# EAGLE design MD2020_02-08 (EAGLE 9.2.0)

## Sheet 1 of 4
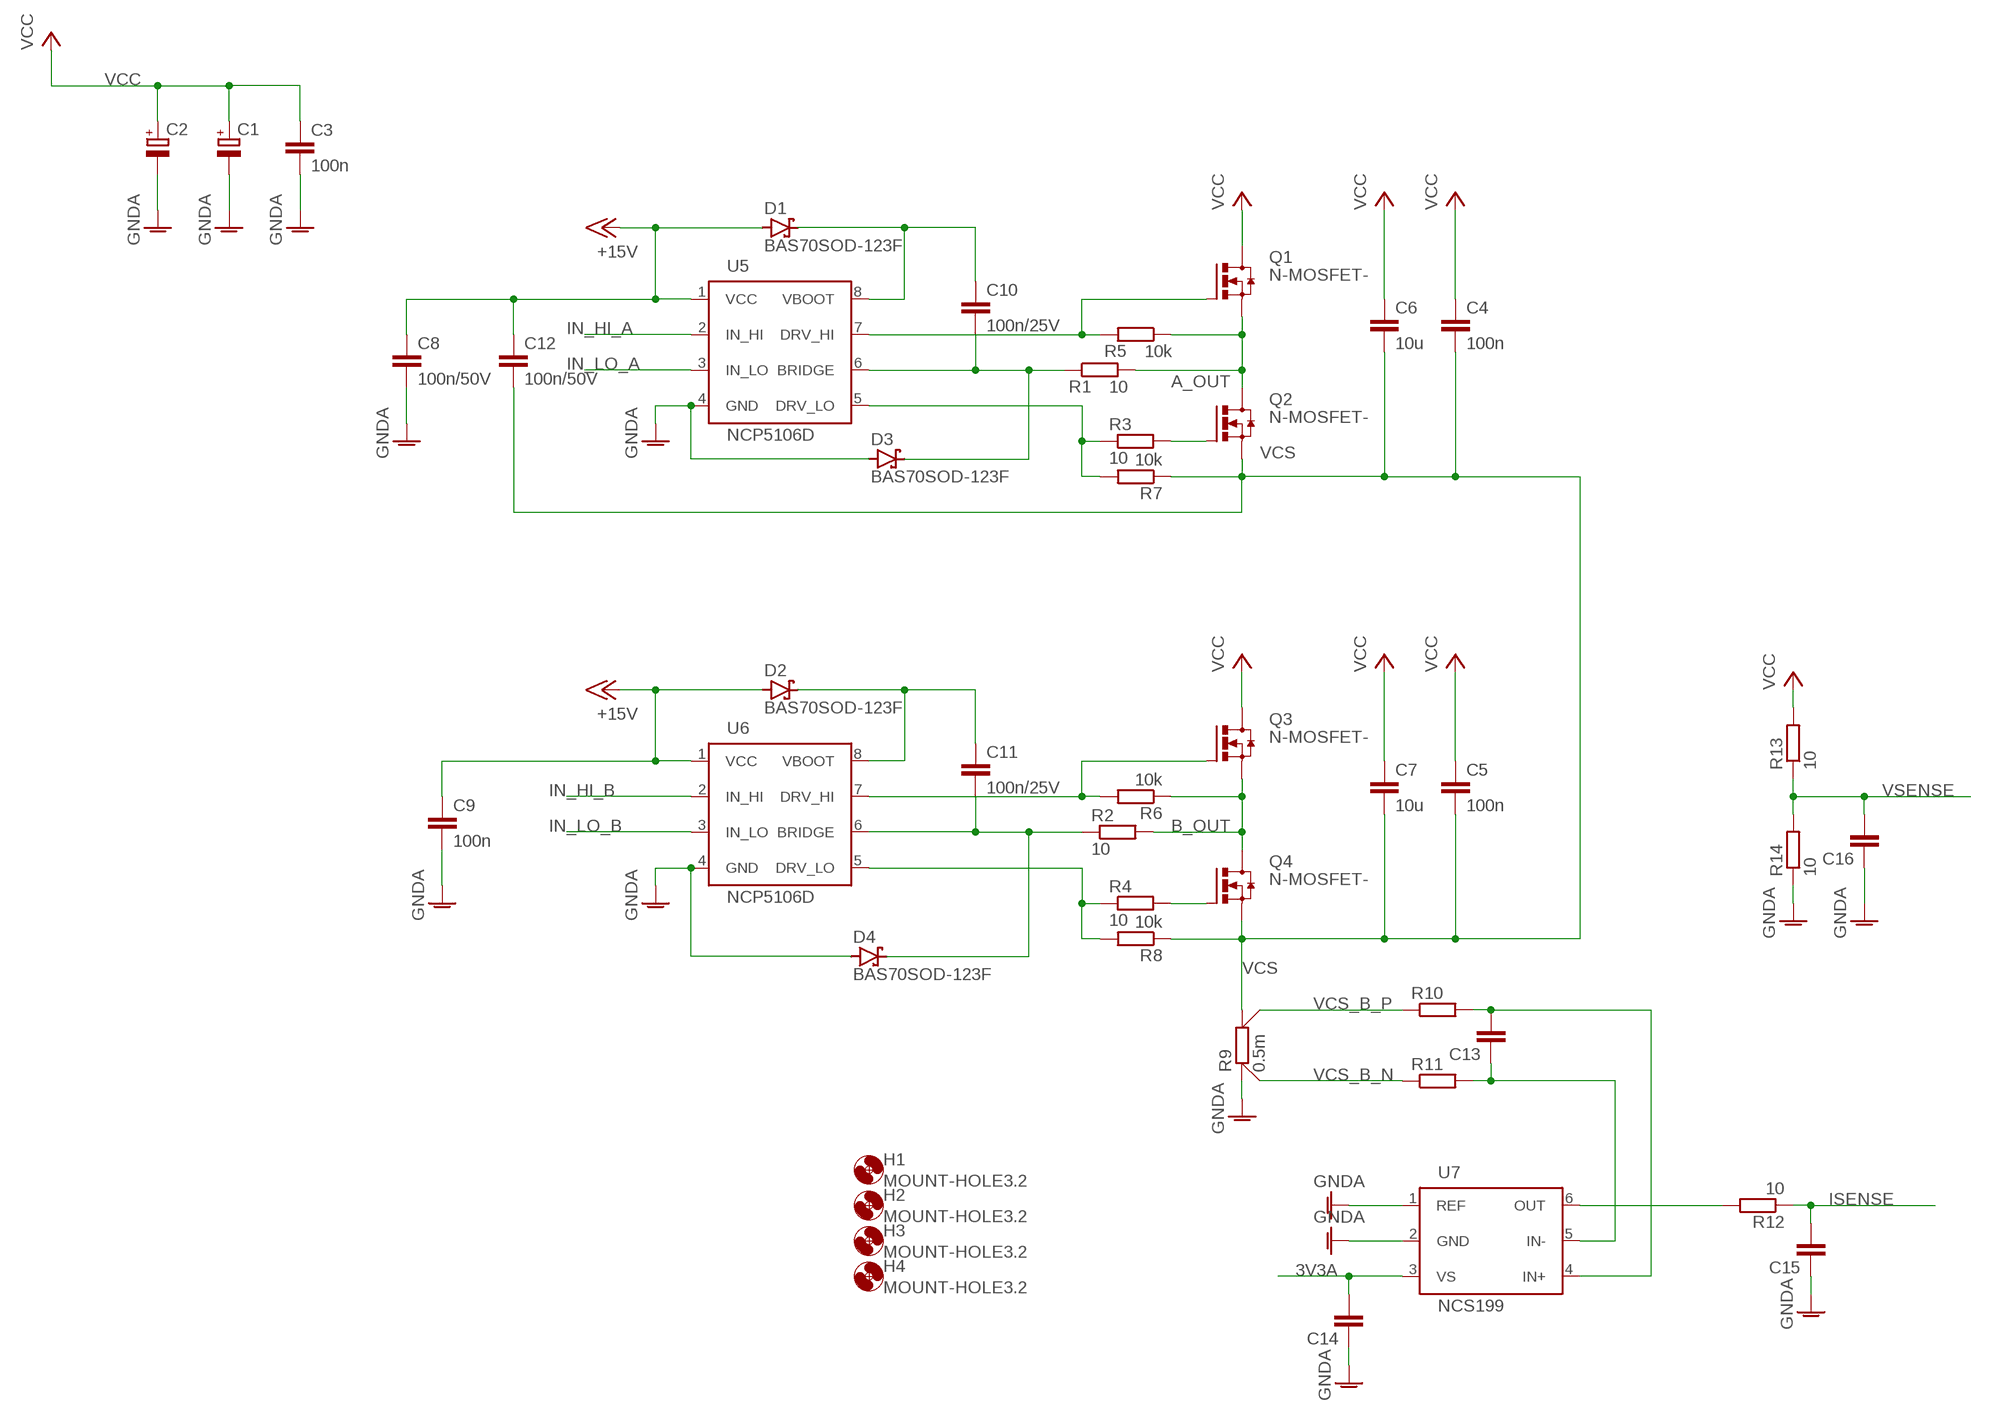
[diagram p0: schematic, sheet 1]

### Parts
C1  CPOL-EUE5-10.5  [E5-10,5]
C2  CPOL-EUE5-10.5  [E5-10,5]
C3  100n  C-EUC0603  [C0603]
C4  100n  C-EUC0603  [C0603]
C5  100n  C-EUC0603  [C0603]
C6  10u  C-EUC1210  [C1210]
C7  10u  C-EUC1210  [C1210]
C8  100n/50V  C-EUC0603  [C0603]
C9  100n  C-EUC0603  [C0603]
C10  100n/25V  C-EUC0603  [C0603]
C11  100n/25V  C-EUC0603  [C0603]
C12  100n/50V  C-EUC0603  [C0603]
C13  C-EUC0603  [C0603]
C14  C-EUC0603  [C0603]
C15  C-EUC0603  [C0603]
C16  C-EUC0603  [C0603]
D1  BAS70SOD-123F  [SOD123F]
D2  BAS70SOD-123F  [SOD123F]
D3  BAS70SOD-123F  [SOD123F]
D4  BAS70SOD-123F  [SOD123F]
H1  MOUNT-HOLE3.2  [3,2]
H2  MOUNT-HOLE3.2  [3,2]
H3  MOUNT-HOLE3.2  [3,2]
H4  MOUNT-HOLE3.2  [3,2]
Q1  N-MOSFET-  [SOT669]
Q2  N-MOSFET-  [SOT669]
Q3  N-MOSFET-  [SOT669]
Q4  N-MOSFET-  [SOT669]
R1  10  R-EU_R0603  [R0603]
R2  10  R-EU_R0603  [R0603]
R3  10  R-EU_R0603  [R0603]
R4  10  R-EU_R0603  [R0603]
R5  10k  R-EU_R0603  [R0603]
R6  10k  R-EU_R0603  [R0603]
R7  10k  R-EU_R0603  [R0603]
R8  10k  R-EU_R0603  [R0603]
R9  0.5m  CSS2H-2512  [CSS2H-2512]
R10  R-EU_R0603  [R0603]
R11  R-EU_R0603  [R0603]
R12  10  R-EU_R0603  [R0603]
R13  10  R-EU_R0603  [R0603]
R14  10  R-EU_R0603  [R0603]
U5  NCP5106D  [SOIC127P600X175-8]
U6  NCP5106D  [SOIC127P600X175-8]
U7  NCS199  [SOT65P210X110-6]

### Nets
3V3A: C14.2 U7.3(VS) ; also sheet 3
+15V: C8.1 C9.1 C12.1 D1.A D2.A U5.1(VCC) U6.1(VCC) ; also sheet 4
A_OUT: Q1.1(SOURCE) Q1.2(SOURCE) Q1.3(SOURCE) Q2.5(DRAIN) R1.2 R5.1
B_OUT: Q3.1(SOURCE) Q3.2(SOURCE) Q3.3(SOURCE) Q4.5(DRAIN) R2.2 R6.1
GNDA: C1.- C2.- C3.2 C8.2 C9.2 C14.1 C15.1 C16.1 D3.A D4.A R9.1$1 R9.1$2 R14.1 U5.4(GND) U6.4(GND) U7.1(REF) U7.2(GND) ; also sheet 2,3,4
IN_HI_A: U5.2(IN_HI) ; also sheet 3
IN_HI_B: U6.2(IN_HI) ; also sheet 3
IN_LO_A: U5.3(IN_LO) ; also sheet 3
IN_LO_B: U6.3(IN_LO) ; also sheet 3
ISENSE: C15.2 R12.1 ; also sheet 3
N$1: Q1.4(GATE) R5.2 U5.7(DRV_HI)
N$2: Q3.4(GATE) R6.2 U6.7(DRV_HI)
N$4: C10.2 D3.C R1.1 U5.6(BRIDGE)
N$5: R4.1 R8.2 U6.5(DRV_LO)
N$6: R12.2 U7.6(OUT)
N$11: R3.1 R7.2 U5.5(DRV_LO)
N$25: C11.2 D4.C R2.1 U6.6(BRIDGE)
N$36: C13.2 R10.2 U7.4(IN+)
N$37: C13.1 R11.2 U7.5(IN-)
N$61: Q2.4(GATE) R3.2
N$64: Q4.4(GATE) R4.2
N$67: C11.1 D2.C U6.8(VBOOT)
N$73: C10.1 D1.C U5.8(VBOOT)
VCC: C1.+ C2.+ C3.1 C4.1 C5.1 C6.1 C7.1 Q1.5(DRAIN) Q3.5(DRAIN) R13.2 ; also sheet 4
VCS: C4.2 C5.2 C6.2 C7.2 C12.2 Q2.1(SOURCE) Q2.2(SOURCE) Q2.3(SOURCE) Q4.1(SOURCE) Q4.2(SOURCE) Q4.3(SOURCE) R7.1 R8.1 R9.2$1 R9.2$2
VCS_B_N: R9.1S R11.1
VCS_B_P: R9.2S R10.1
VSENSE: C16.2 R13.1 R14.2 ; also sheet 3

## Sheet 2 of 4
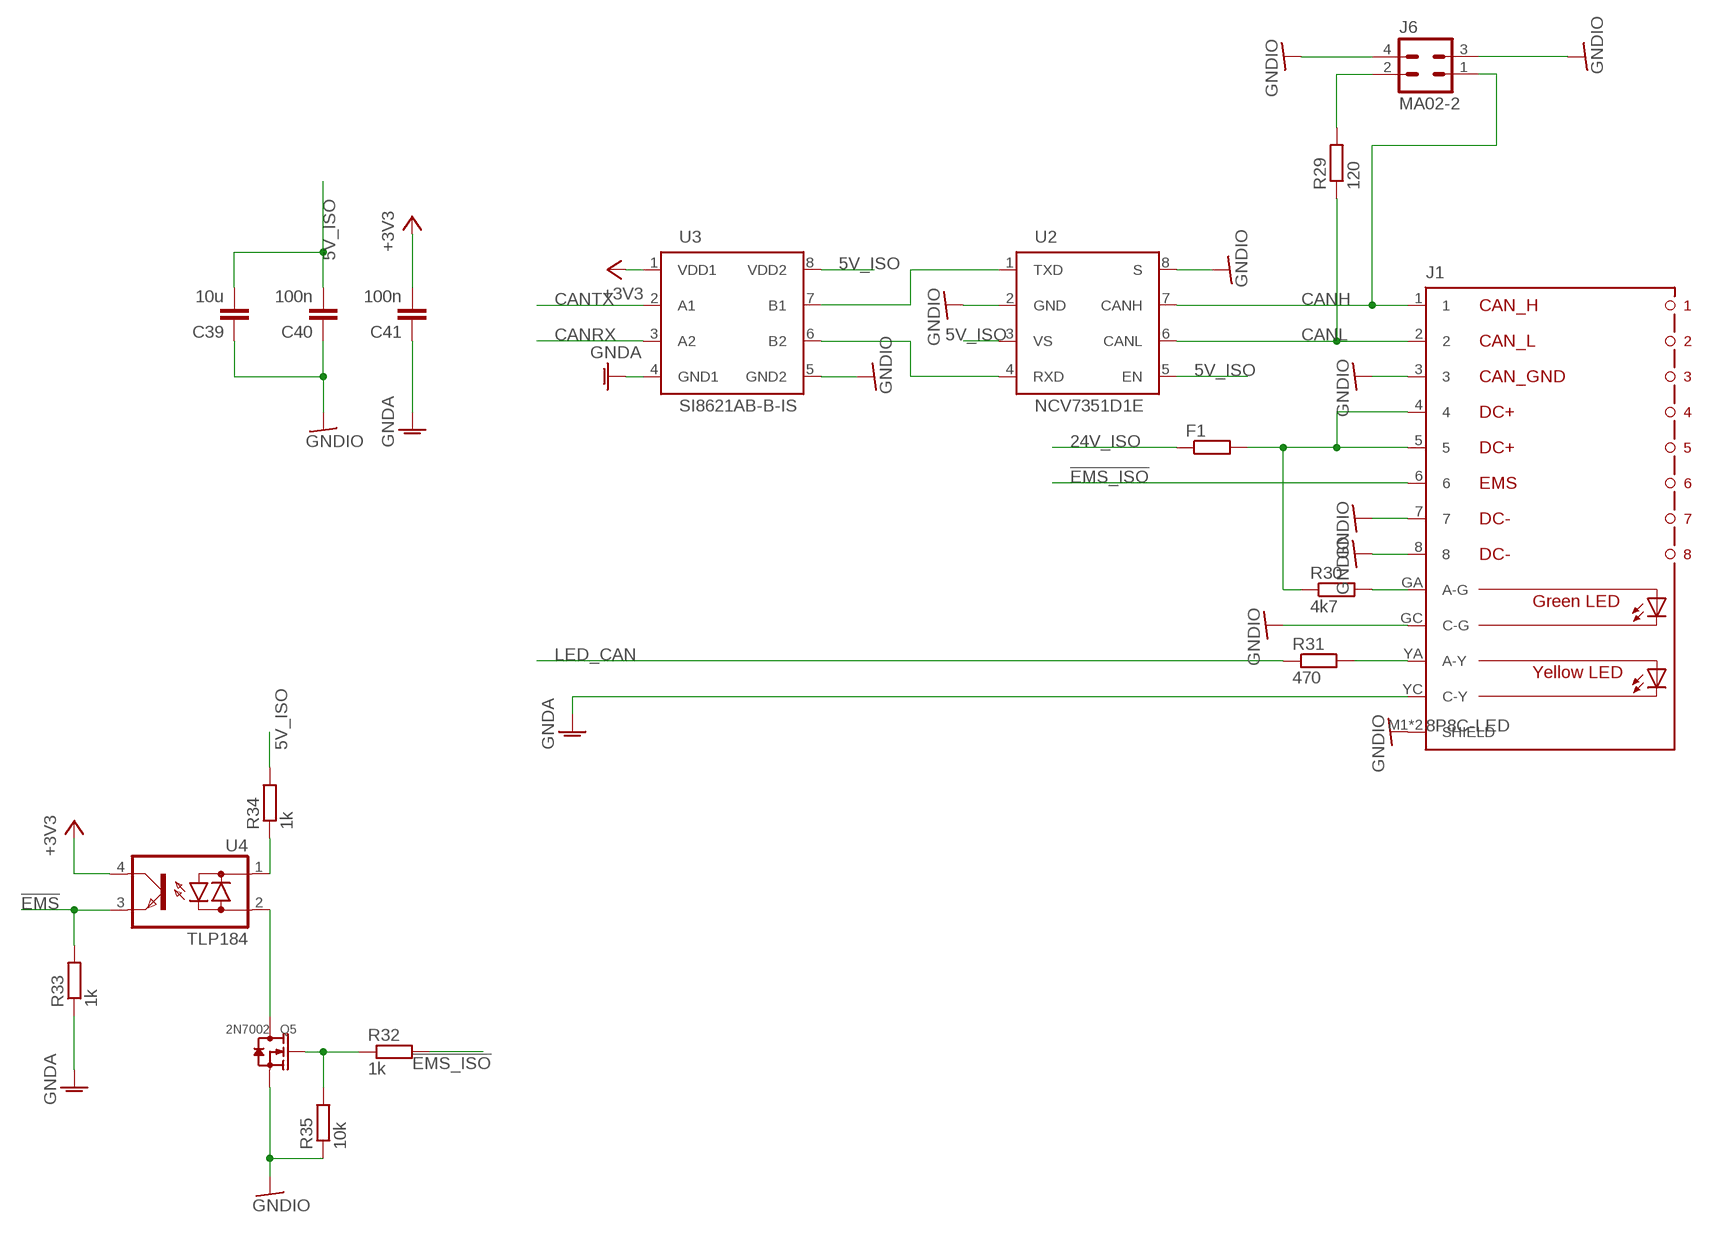
[diagram p1: schematic, sheet 2]

### Parts
C39  10u  C-EUC0805  [C0805]
C40  100n  C-EUC0603  [C0603]
C41  100n  C-EUC0603  [C0603]
F1  R-EU_R1206  [R1206]
J1  8P8C-LED  [8P8C-LED]
J6  MA02-2  [MA02-2W]
Q5  2N7002  SMD-MOSFET-N-CH-60V-300MA-LOGIC-LEVEL-FET-2N7002(SOT-23)  [SOT-23]
R29  120  R-EU_R0603  [R0603]
R30  4k7  R-EU_R0603  [R0603]
R31  470  R-EU_R0603  [R0603]
R32  1k  R-EU_R0603  [R0603]
R33  1k  R-EU_R0603  [R0603]
R34  1k  R-EU_R0603  [R0603]
R35  10k  R-EU_R0603  [R0603]
U2  NCV7351D1E  [SO08]
U3  SI8621AB-B-IS  [SO08]
U4  TLP184  [11-4M1S]

### Nets
5V_ISO: C39.2 C40.2 R34.2 U2.3(VS) U2.5(EN) U3.8(VDD2) ; also sheet 4
24V_ISO: F1.1 ; also sheet 4
!EMS: R33.2 U4.3(E) ; also sheet 3
!EMS_ISO: J1.6 R32.2
+3V3: C41.2 U3.1(VDD1) U4.4(C) ; also sheet 3,4
CANH: J1.1 J6.1 U2.7(CANH)
CANL: J1.2 R29.1 U2.6(CANL)
CANRX: U3.3(A2) ; also sheet 3
CANTX: U3.2(A1) ; also sheet 3
GNDA: C41.1 J1.YC(C-Y) R33.1 U3.4(GND1) ; also sheet 1,3,4
GNDIO: C39.1 C40.1 J1.3 J1.7 J1.8 J1.GC(C-G) J1.M1(SHIELD) J1.M2(SHIELD) J6.3 J6.4 Q5.2(S) R35.1 U2.2(GND) U2.8(S) U3.5(GND2) ; also sheet 4
LED_CAN: R31.1 ; also sheet 3
N$8: F1.2 J1.4 J1.5 R30.1
N$9: J6.2 R29.2
N$18: J1.GA(A-G) R30.2
N$20: J1.YA(A-Y) R31.2
N$22: Q5.1(G) R32.1 R35.2
N$23: U2.1(TXD) U3.7(B1)
N$27: U2.4(RXD) U3.6(B2)
N$30: Q5.3(D) U4.2(AC2)
N$31: R34.1 U4.1(AC1)

## Sheet 3 of 4
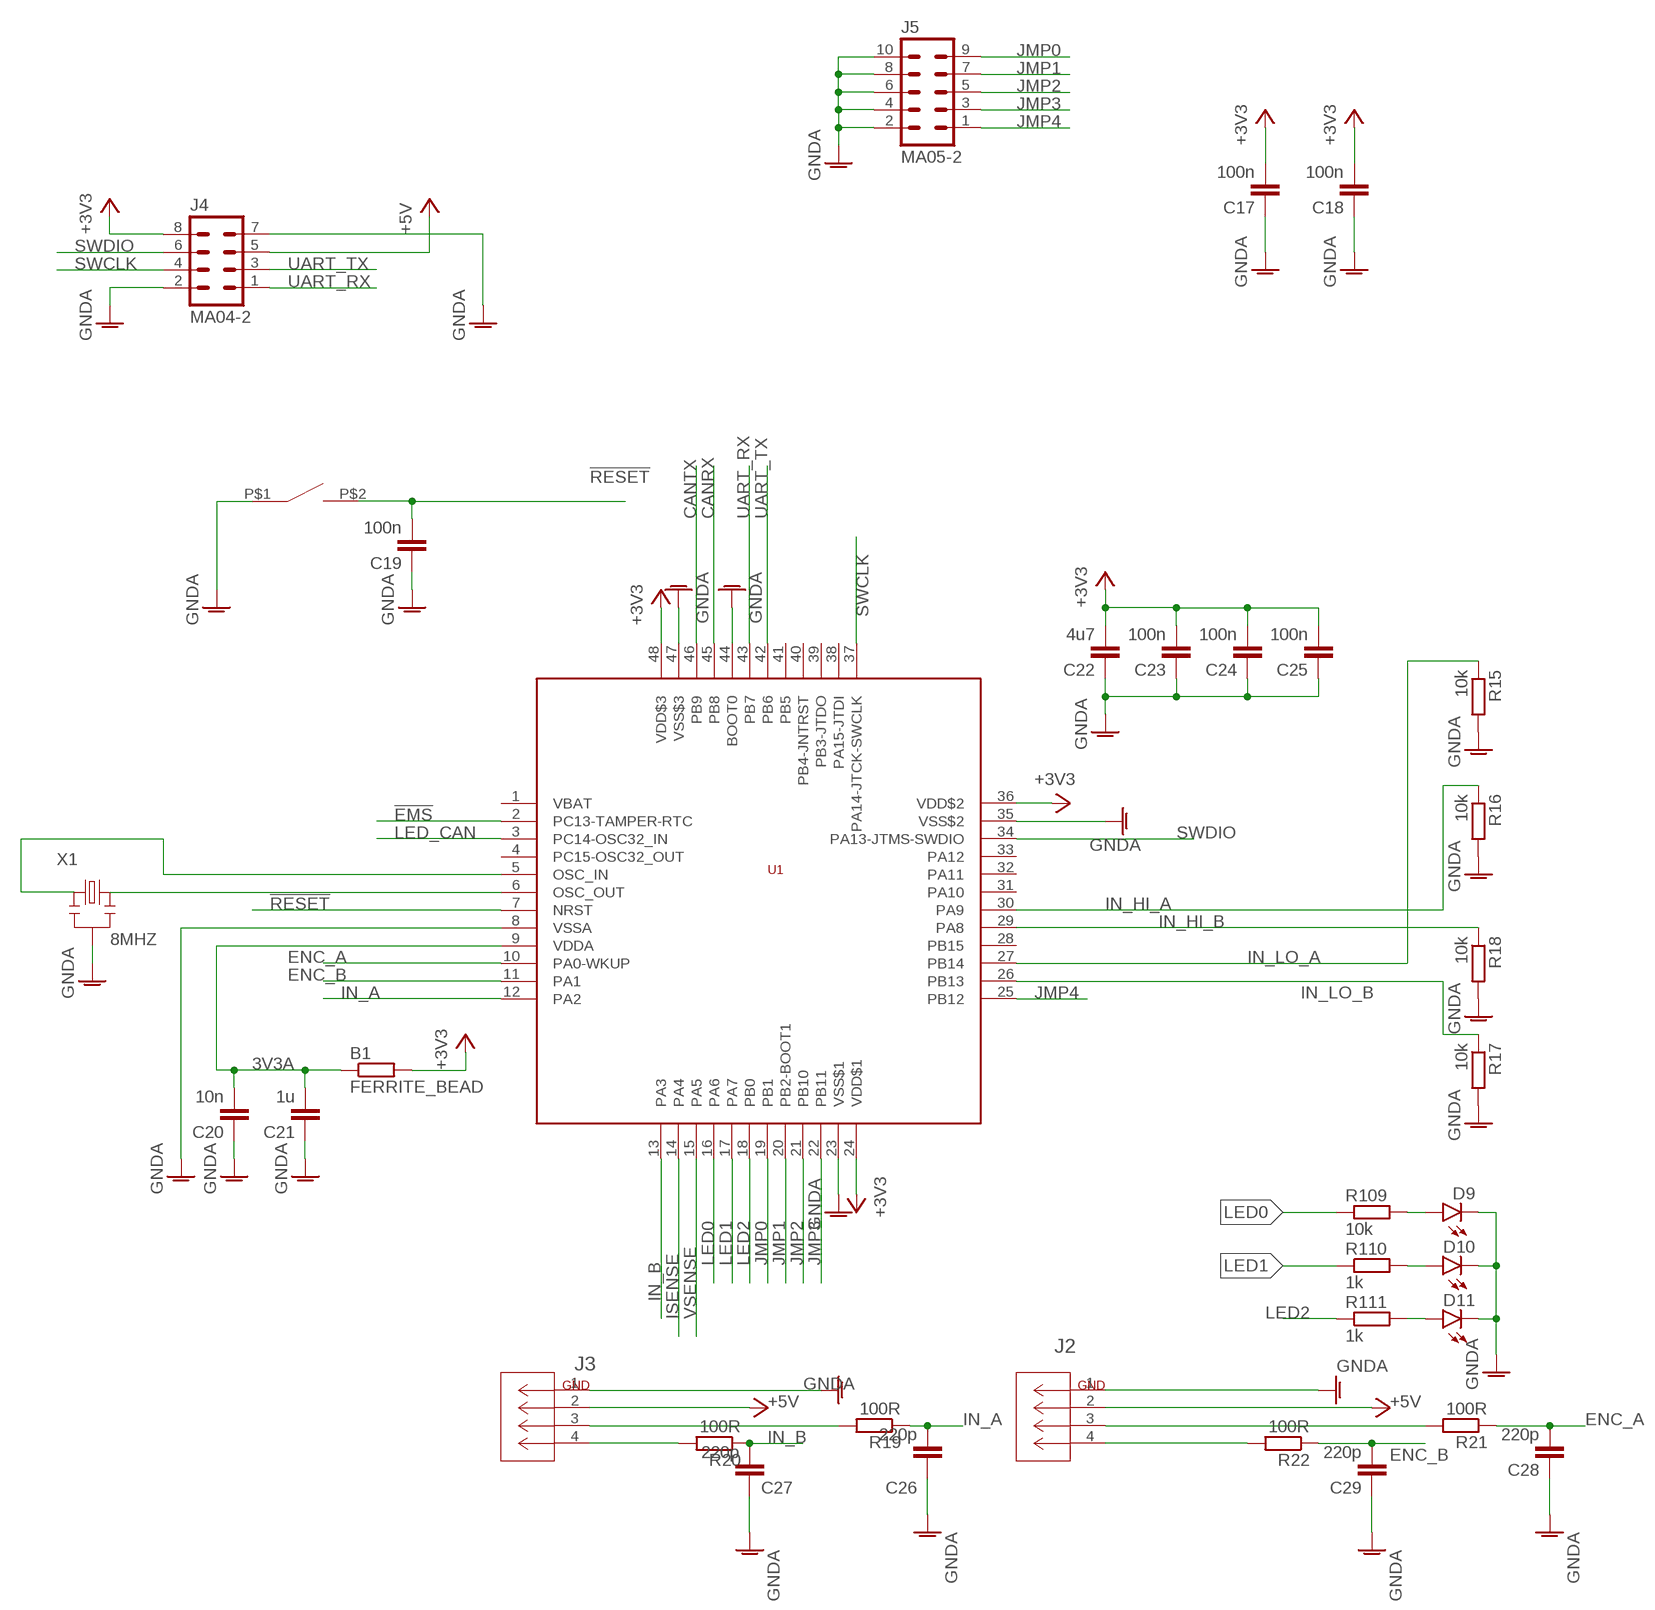
[diagram p2: schematic, sheet 3]

### Parts
B1  FERRITE_BEAD  R-EU_R0603  [R0603]
C17  100n  C-EUC0603  [C0603]
C18  100n  C-EUC0603  [C0603]
C19  100n  C-EUC0603  [C0603]
C20  10n  C-EUC0603  [C0603]
C21  1u  C-EUC0603  [C0603]
C22  4u7  C-EUC0805  [C0805]
C23  100n  C-EUC0603  [C0603]
C24  100n  C-EUC0603  [C0603]
C25  100n  C-EUC0603  [C0603]
C26  220p  C-EUC0603  [C0603]
C27  220p  C-EUC0603  [C0603]
C28  220p  C-EUC0603  [C0603]
C29  220p  C-EUC0603  [C0603]
D9  LEDCHIPLED_0805  [CHIPLED_0805]
D10  LEDCHIPLED_0805  [CHIPLED_0805]
D11  LEDCHIPLED_0805  [CHIPLED_0805]
J2  1744426-4  [CONN4_1744426-4]
J3  1744426-4  [CONN4_1744426-4]
J4  MA04-2  [MA04-2W]
J5  MA05-2  [MA05-2W]
R15  10k  R-EU_R0603  [R0603]
R16  10k  R-EU_R0603  [R0603]
R17  10k  R-EU_R0603  [R0603]
R18  10k  R-EU_R0603  [R0603]
R19  100R  R-EU_R0603  [R0603]
R20  100R  R-EU_R0603  [R0603]
R21  100R  R-EU_R0603  [R0603]
R22  100R  R-EU_R0603  [R0603]
R109  10k  R-EU_R0603  [R0603]
R110  1k  R-EU_R0603  [R0603]
R111  1k  R-EU_R0603  [R0603]
S1  SWITCH_TACTILETOP  [SWITCH_TACTILE_3X6]
U1  STM32F103C8  [LQFP48]
X1  8MHZ  SMD-CRYSTAL-8MHZ--0.3%-150R(3P-3.6X1.3MM)  [X3-SMD-3.6X1.3X0.8MM]

### Nets
3V3A: B1.1 C20.2 C21.2 U1.9(VDDA) ; also sheet 1
!EMS: U1.2(PC13-TAMPER-RTC) ; also sheet 2
!RESET: C19.2 S1.P$2 U1.7(NRST)
+3V3: B1.2 C17.2 C18.2 C22.2 C23.2 C24.2 C25.2 J4.8 U1.24(VDD$1) U1.36(VDD$2) U1.48(VDD$3) ; also sheet 2,4
+5V: J2.2 J3.2 J4.5 ; also sheet 4
CANRX: U1.45(PB8) ; also sheet 2
CANTX: U1.46(PB9) ; also sheet 2
ENC_A: C28.2 R21.1 U1.10(PA0-WKUP)
ENC_B: C29.2 R22.1 U1.11(PA1)
GNDA: C17.1 C18.1 C19.1 C20.1 C21.1 C22.1 C23.1 C24.1 C25.1 C26.1 C27.1 C28.1 C29.1 D9.C D10.C D11.C J2.1 J3.1 J4.2 J4.7 J5.2 J5.4 J5.6 J5.8 J5.10 R15.2 R16.2 R17.2 R18.2 S1.P$1 U1.8(VSSA) U1.23(VSS$1) U1.35(VSS$2) U1.44(BOOT0) U1.47(VSS$3) X1.2 ; also sheet 1,2,4
IN_A: C26.2 R19.1 U1.12(PA2)
IN_B: C27.2 R20.1 U1.13(PA3)
IN_HI_A: R16.1 U1.30(PA9) ; also sheet 1
IN_HI_B: R18.1 U1.29(PA8) ; also sheet 1
IN_LO_A: R15.1 U1.27(PB14) ; also sheet 1
IN_LO_B: R17.1 U1.26(PB13) ; also sheet 1
ISENSE: U1.14(PA4) ; also sheet 1
JMP0: J5.9 U1.19(PB1)
JMP1: J5.7 U1.20(PB2-BOOT1)
JMP2: J5.5 U1.21(PB10)
JMP3: J5.3 U1.22(PB11)
JMP4: J5.1 U1.25(PB12)
LED0: R109.1 U1.16(PA6)
LED1: R110.1 U1.17(PA7)
LED2: R111.1 U1.18(PB0)
LED_CAN: U1.3(PC14-OSC32_IN) ; also sheet 2
N$3: D10.A R110.2
N$7: D9.A R109.2
N$10: U1.6(OSC_OUT) X1.3
N$12: J2.4 R22.2
N$15: J3.4 R20.2
N$16: J2.3 R21.2
N$17: J3.3 R19.2
N$19: U1.5(OSC_IN) X1.1
N$21: D11.A R111.2
SWCLK: J4.4 U1.37(PA14-JTCK-SWCLK)
SWDIO: J4.6 U1.34(PA13-JTMS-SWDIO)
UART_RX: J4.1 U1.43(PB7)
UART_TX: J4.3 U1.42(PB6)
VSENSE: U1.15(PA5) ; also sheet 1
Unconnected: U1.1(VBAT) U1.4(PC15-OSC32_OUT) U1.28(PB15) U1.31(PA10) U1.32(PA11) U1.33(PA12) U1.38(PA15-JTDI) U1.39(PB3-JTDO) U1.40(PB4-JNTRST) U1.41(PB5)

## Sheet 4 of 4
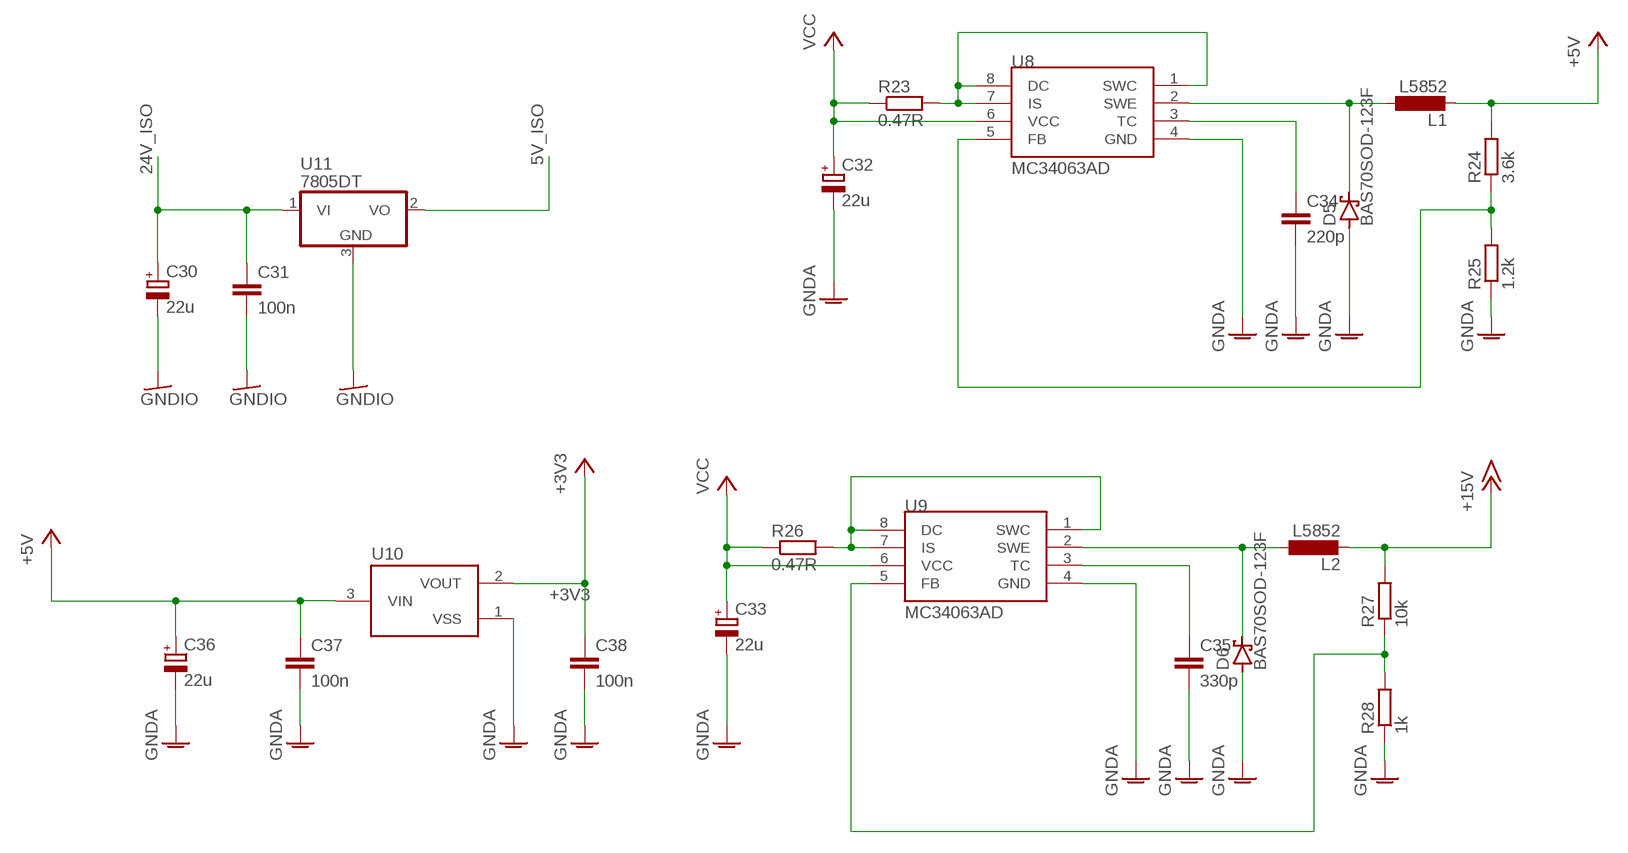
[diagram p3: schematic, sheet 4]

### Parts
C30  22u  CPOL-EUE2.5-5  [E2,5-5]
C31  100n  C-EUC0603  [C0603]
C32  22u  CPOL-EUE2-5  [E2-5]
C33  22u  CPOL-EUE2-5  [E2-5]
C34  220p  C-EUC0603  [C0603]
C35  330p  C-EUC0603  [C0603]
C36  22u  CPOL-EUE2.5-5  [E2,5-5]
C37  100n  C-EUC0603  [C0603]
C38  100n  C-EUC0603  [C0603]
D5  BAS70SOD-123F  [SOD123F]
D6  BAS70SOD-123F  [SOD123F]
L1  L5852  [L5852]
L2  L5852  [L5852]
R23  0.47R  R-EU_R0603  [R0603]
R24  3.6k  R-EU_R0603  [R0603]
R25  1.2k  R-EU_R0603  [R0603]
R26  0.47R  R-EU_R0603  [R0603]
R27  10k  R-EU_R0603  [R0603]
R28  1k  R-EU_R0603  [R0603]
U8  MC34063AD  [SOIC8]
U9  MC34063AD  [SOIC8]
U10  XC6206  [SOT95P240X110-3]
U11  7805DT  [TO252]

### Nets
5V_ISO: U11.2(VO) ; also sheet 2
24V_ISO: C30.+ C31.1 U11.1(VI) ; also sheet 2
+3V3: C38.1 U10.2(VOUT) ; also sheet 2,3
+5V: C36.+ C37.1 L1.P$2 R24.2 U10.3(VIN) ; also sheet 3
+15V: L2.P$2 R27.2 ; also sheet 1
GNDA: C32.- C33.- C34.2 C35.2 C36.- C37.2 C38.2 D5.A D6.A R25.1 R28.1 U8.4(GND) U9.4(GND) U10.1(VSS) ; also sheet 1,2,3
GNDIO: C30.- C31.2 U11.3(GND) ; also sheet 2
N$13: R23.2 U8.1(SWC) U8.7(IS) U8.8(DC)
N$14: D5.C L1.P$1 U8.2(SWE)
N$24: C34.1 U8.3(TC)
N$26: R24.1 R25.2 U8.5(FB)
N$28: R26.2 U9.1(SWC) U9.7(IS) U9.8(DC)
N$29: D6.C L2.P$1 U9.2(SWE)
N$32: C35.1 U9.3(TC)
N$33: R27.1 R28.2 U9.5(FB)
VCC: C32.+ C33.+ R23.1 R26.1 U8.6(VCC) U9.6(VCC) ; also sheet 1

## Library data of the parts
B1 = rcl:R-EU_: RESISTOR, European symbol
C1 C2 C30 C32 C33 C36 = rcl:CPOL-EU: POLARIZED CAPACITOR, European symbol
C3-C5 C8-C12 C17-C19 C23-C25 C31 C37 C38 C40 C41 = rcl:C-EU: CAPACITOR, European symbol; MPN: CC0603KRX7R9BB104
C6 C7 = rcl:C-EU: CAPACITOR, European symbol; MPN: CL31A106KBHNNNE
C13-C16 = rcl:C-EU: CAPACITOR, European symbol; SPICEPREFIX: C
C20 = rcl:C-EU: CAPACITOR, European symbol
C21 = rcl:C-EU: CAPACITOR, European symbol; MPN: CC0603KRX7R8BB105
C22 = rcl:C-EU: CAPACITOR, European symbol; MPN: CC0603KRX5R6BB475
C26-C29 = rcl:C-EU: CAPACITOR, European symbol; MPN: CL10B221KB8NNNC
C34 = rcl:C-EU: CAPACITOR, European symbol; MPN: CL10B221KB8NNNC; SPICEPREFIX: C
C35 = rcl:C-EU: CAPACITOR, European symbol; MPN: CL10B331KB8NNNC; SPICEPREFIX: C
C39 = rcl:C-EU: CAPACITOR, European symbol; MPN: CC0805ZKY5V6BB106
D1-D6 = diode:BAS70: Silicon Schottky Diodes General-purpose diode for high-speed switching; MPN: PMEG4010EH,115
D9-D11 = led:LED: LED OSRAM: - CHIPLED LG R971, LG N971, LY N971, LG Q971, LY Q971, LO R971, LY R971 LH N974, LH R974 LS Q976, LO Q976, LY Q976 LO Q996 - Hyper CHIPLED LW Q18S LB Q993, LB Q99A, LB R99A - SideLED LS A670, LO A670, LY A670, LG A670, LP A670 LB A673, LV A673, LT A673, LW A673 LH A674 LY A675 LS A676, LA A676, LO A676, LY A676, LW A676 LS A679, LY A679, LG A679 - Hyper Micro SIDELED® LS Y876, LA Y876, LO Y876, LY Y876 LT Y87S - SmartLED LW L88C, LW L88S LB L89C, LB L89S, LG L890 LS L89K, LO L89K, LY L89K LS L896, LA L896, LO L896, LY L896 - TOPLED LS T670, LO T670, LY T670, LG T670, LP T670 LSG T670, LSP T670, LSY T670, LOP T670, LYG T670 LG T671, LOG T671, LSG T671 LB T673, LV T673, LT T673, LW T673 LH T674 LS T676, LA T676, LO T676, LY T676, LB T676, LH T676, LSB T676, LW T676 LB T67C, LV T67C, LT T67C, LS T67K, LO T67K, LY T67K, LW E67C LS E67B, LA E67B, LO E67B, LY E67B, LB E67C, LV E67C, LT E67C LW T67C LS T679, LY T679, LG T679 LS T770, LO T770, LY T770, LG T770, LP T770 LB T773, LV T773, LT T773, LW T773 LH T774 LS E675, LA E675, LY E675, LS T675 LS T776, LA T776, LO T776, LY T776, LB T776 LHGB T686 LT T68C, LB T68C - Hyper Mini TOPLED® LB M676 - Mini TOPLED Santana® LG M470 LS M47K, LO M47K, LY M47K Source: http://www.osram.convergy.de LUXEON: - LUMILED® LXK2-PW12-R00, LXK2-PW12-S00, LXK2-PW14-U00, LXK2-PW14-V00 LXK2-PM12-R00, LXK2-PM12-S00, LXK2-PM14-U00 LXK2-PE12-Q00, LXK2-PE12-R00, LXK2-PE12-S00, LXK2-PE14-T00, LXK2-PE14-U00 LXK2-PB12-K00, LXK2-PB12-L00, LXK2-PB12-M00, LXK2-PB14-N00, LXK2-PB14-P00, LXK2-PB14-Q00 LXK2-PR12-L00, LXK2-PR12-M00, LXK2-PR14-Q00, LXK2-PR14-R00 LXK2-PD12-Q00, LXK2-PD12-R00, LXK2-PD12-S00 LXK2-PH12-R00, LXK2-PH12-S00 LXK2-PL12-P00, LXK2-PL12-Q00, LXK2-PL12-R00 Source: www.luxeon.com KINGBRIGHT: KA-3528ASYC Source: www.kingbright.com
F1 R10 R11 = rcl:R-EU_: RESISTOR, European symbol; SPICEPREFIX: R
H1-H4 = holes:MOUNT-HOLE: MOUNTING HOLE with drill center marker
J1 = con-rj45:8P8C-LED: generic 8P8C connector with two LED's; OC_FARNELL: unknown; OC_NEWARK: unknown
J2 J3 = EP2.5:1744426-4; MANUFACTURER_PART_NUMBER: 17444264; VENDOR: TE Connectivity
J4 = con-headers:MA04-2
J5 = con-headers:MA05-2
J6 = con-headers:MA02-2
L1 L2 = l_ysk:L5852
Q1-Q4 = nexperia:N-MOSFET-*
Q5 = OPL_Discrete_Semiconductor:SMD-MOSFET-N-CH-60V-300MA-LOGIC-LEVEL-FET-2N7002(SOT-23): 305030028; MPN: 2N7002,215
R1-R4 R12-R14 = rcl:R-EU_: RESISTOR, European symbol; MPN: RC0603FR-0710RL
R5-R8 R15-R18 R109 = rcl:R-EU_: RESISTOR, European symbol; MPN: RC0603FR-0710KL
R9 = r_shunt:CSS2H-2512: Bourns Model CSS2H-2512 Series Current Sense Resistor <https://www.bourns.com/docs/Product-Datasheets/css2h-2512.pdf>
R19-R22 = rcl:R-EU_: RESISTOR, European symbol; MPN: RC0603JR-07100RL
R23 R26 = rcl:R-EU_: RESISTOR, European symbol; MPN: 0603WAF470LT5E; SPICEPREFIX: R
R24 = rcl:R-EU_: RESISTOR, European symbol; MPN: RC0603JR-073K6L; SPICEPREFIX: R
R25 = rcl:R-EU_: RESISTOR, European symbol; MPN: RC0603JR-071K2L; SPICEPREFIX: R
R27 R35 = rcl:R-EU_: RESISTOR, European symbol; MPN: RC0603FR-0710KL; SPICEPREFIX: R
R28 R32-R34 = rcl:R-EU_: RESISTOR, European symbol; MPN: RC0603FR-071KL; SPICEPREFIX: R
R29 = rcl:R-EU_: RESISTOR, European symbol; MPN: RC0603JR-07120RL; SPICEPREFIX: R
R30 = rcl:R-EU_: RESISTOR, European symbol; MPN: RC0603FR-074K7L; SPICEPREFIX: R
R31 = rcl:R-EU_: RESISTOR, European symbol; MPN: RC0603JR-07470RL; SPICEPREFIX: R
R110 R111 = rcl:R-EU_: RESISTOR, European symbol; MPN: RC0603FR-071KL
S1 = switch-tactile:SWITCH_TACTILE
U1 = stm32_mcu:STM32F103C8: STMicroelectronics STM32F103C8 Mainstream Performance line, ARM Cortex-M3 MCU with 64 Kbytes Flash, 72 MHz CPU, motor control, USB and CAN references: datasheet <https://www.st.com/resource/en/datasheet/stm32f103c8.pdf> product page <https://www.st.com/ja/microcontrollers/stm32f103c8.html>; MPN: STM32F103C8T6
U2 = on-semi:NCV7351D1E: High Speed CAN Transceiver Source: NCV7351-D.PDF <http://www.onsemi.com/PowerSolutions/document/NCV7351-D.PDF>
U3 = silabs:SI8621AB-B-IS: 1 Mbps Digital Isolator 1 Mbps, 2.5 kVRMS Digital Isolator Source: Si86xx.pdf <https://www.silabs.com/documents/public/data-sheets/Si86xx.pdf>
U4 = md201x:TLP184
U5 U6 = on-semi:NCP5106
U7 = on-semi:NCS199
U8 U9 = mc34063:MC34063; MPN: MC34063ADR2G
U10 = torex:XC6206
U11 = linear:78*: Positive VOLTAGE REGULATOR Source: http://cache.national.com/ds/LM/LM78L05.pdf http://www.fairchildsemi.com/ds/LM/LM7805.pdf
X1 = OPL_Crystal Oscillator:SMD-CRYSTAL-8MHZ--0.3%-150R(3P-3.6X1.3MM): 306010053; MPN: CSTCE8M00G55-RO

## Net classes
1 current_sense: width 0.254 mm

## Board
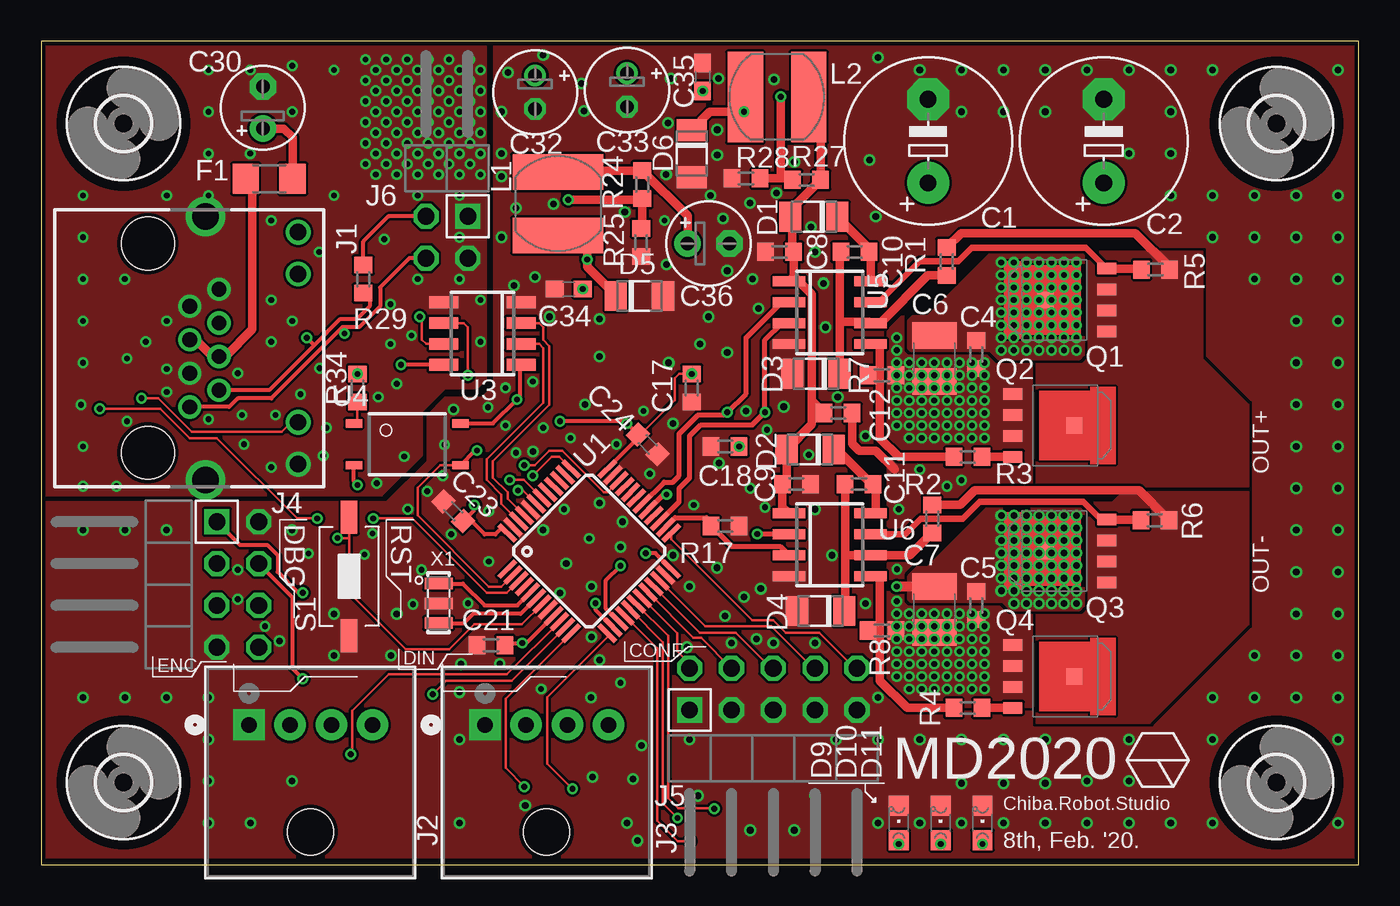
[diagram p4: board, top side]
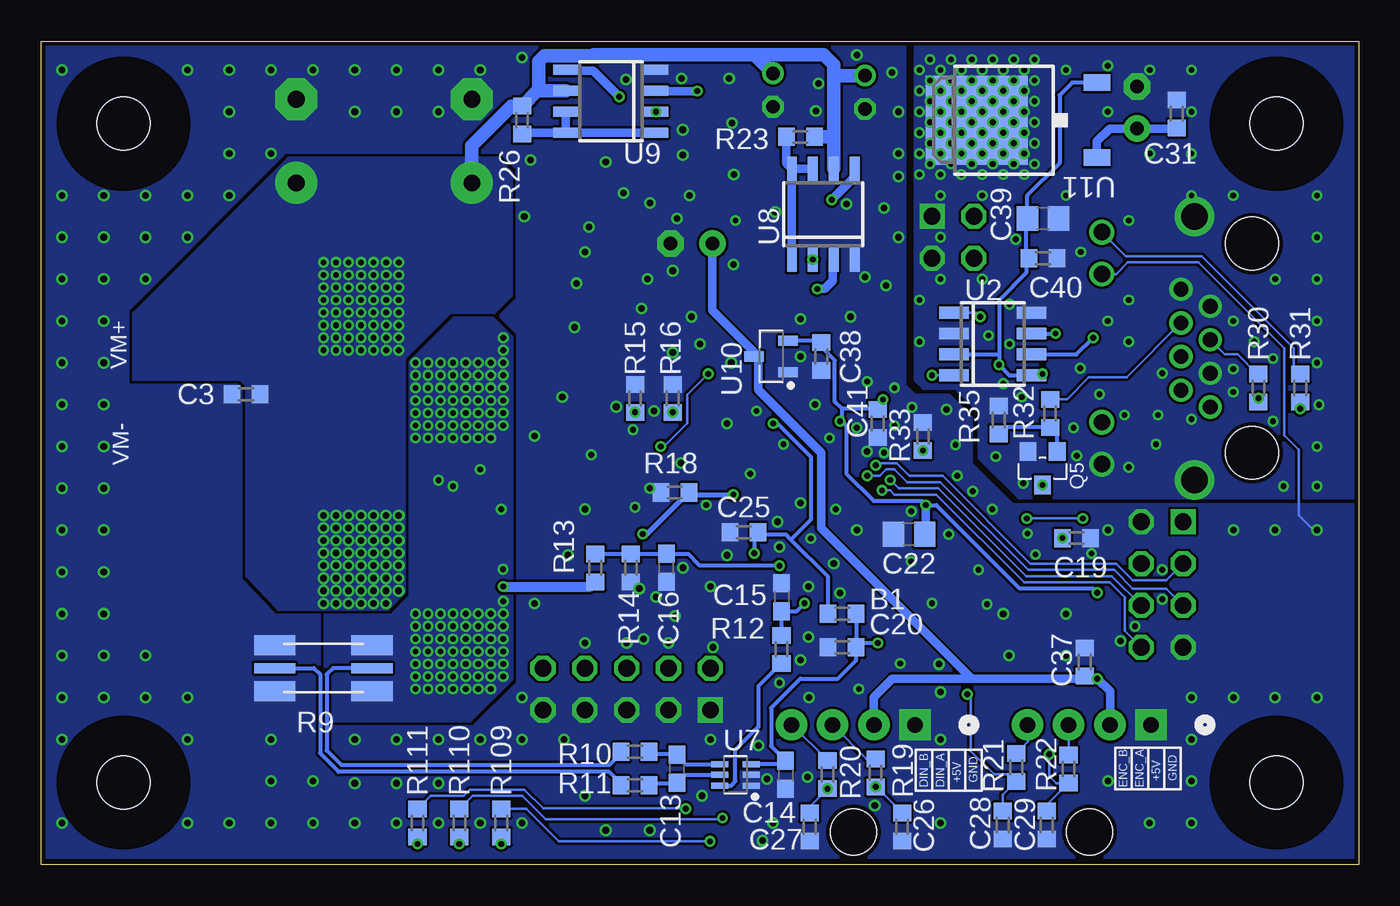
[diagram p5: board, bottom side, seen from below]

Size 80 x 50 mm. Coordinates in mm from the lower left corner, seen from the top.
Outline: 0,0 80,0 80,50 0,50 0,0
Copper layers (1*16): Top 0.035mm / dielectric 1.5mm / Bottom 0.035mm
Design rules "SeeedStudio_2layer_DRU_no_angle_20140221": minimum track width 6mil, minimum drill 12mil, track to track 6mil, track to pad 6mil, pad to pad 6mil, via to via 6mil, smd to smd 0mil, copper to edge 10mil, drill to drill 10mil, minimum pad ring 10mil, minimum via ring 6mil, stop-mask expansion 2mil, vias tented up to drill 100mil, thermal gap 10mil
tKeepout: 11 lines
bKeepout: 6 lines

### Footprints (pad centres in the part's own frame; a part is rotated, then mirrored left to right if it is on the bottom)
R0603 = smd 1 x 1.1: 1 -0.85,0; 2 0.85,0
E5-10,5 = drill 1.016 pad 2.54: + -2.54,0 | drill 1.016 pad 2.54 octagon: - 2.54,0
C0603 = smd 1 x 1.1: 1 -0.85,0; 2 0.85,0
C1210 = smd 1.6 x 2.7: 1 -1.4,0; 2 1.4,0
C0603' = smd 1.1 x 1: 1 -0.85,0; 2 0.85,0
C0805 = smd 1.3 x 1.5: 1 -0.95,0; 2 0.95,0
E2,5-5 = drill 0.813 pad 1.6: + -1.27,0 | drill 0.813 pad 1.6 octagon: - 1.27,0
E2-5 = drill 0.813 pad 1.27: + -1.016,0 | drill 0.813 pad 1.27 octagon: - 1.016,0
SOD123F = smd 1.34 x 1.8: A 1.43,0; C -1.43,0
CHIPLED_0805 = smd 1.2 x 1.2: A 0,-1.05; C 0,1.05
R1206 = smd 1.6 x 1.803: 1 -1.422,0; 2 1.422,0
3,2 = hole 3.2: 0,0
8P8C-LED = drill 0.9 pad 1.3: 1 3.57,-3.81; 2 2.55,-2.03; 3 1.53,-3.81; 4 0.51,-2.03; 5 -0.51,-3.81; 6 -1.53,-2.03; 7 -2.55,-3.81; 8 -3.57,-2.03 | drill 1 pad 1.422: GA 4.5,2.78; GC 7.04,2.78; YA -7.04,2.78; YC -4.5,2.78 | drill 1.6 pad 2.184: M1 -8,-2.85; M2 8,-2.85 | hole 3.2: 6.35,-6.35; -6.35,-6.35
CONN4_1744426-4 = drill 0.94 pad 1.905 square: 1 7.493,0 | drill 0.94 pad 1.905: 2 5.004,0; 3 2.489,0; 4 0,0 | hole 2.794: 3.759,6.502
MA04-2W = drill 1.016 octagon: 1 -3.81,-1.27; 2 -3.81,1.27; 3 -1.27,-1.27; 4 -1.27,1.27; 5 1.27,-1.27; 6 1.27,1.27; 7 3.81,-1.27 | drill 1.016 square: 8 3.81,1.27
MA05-2W = drill 1.016 octagon: 1 -5.08,-1.27; 2 -5.08,1.27; 3 -2.54,-1.27; 4 -2.54,1.27; 5 0,-1.27; 6 0,1.27; 7 2.54,-1.27; 8 2.54,1.27; 9 5.08,-1.27 | drill 1.016 square: 10 5.08,1.27
MA02-2W = drill 1.016 octagon: 1 -1.27,-1.27; 2 -1.27,1.27; 3 1.27,-1.27 | drill 1.016 square: 4 1.27,1.27
L5852 = smd 2.15 x 5.5: P$1 1.925,0; P$2 -1.925,0
SOT669 = smd 1.15 x 0.7: 1 -2.725,1.905; 2 -2.725,0.635; 3 -2.725,-0.635; 4 -2.725,-1.905 | smd 1 x 1: 5 1,0
SOT-23 = smd 1.016 x 1.143: 1 -0.889,-1.016; 2 0.889,-1.016; 3 0,1.016
CSS2H-2512 = smd 2.5 x 1.2: 1$1 -2.95,1.4; 1$2 -2.95,-1.4; 2$1 2.95,1.4; 2$2 2.95,-1.4 | smd 2.5 x 0.6: 1S -2.95,0; 2S 2.95,0
SWITCH_TACTILE_3X6 = smd 2 x 1: P$1 -3.6,0; P$2 3.6,0
LQFP48 = smd 1.4 x 0.3: 1 -4.3,2.75; 2 -4.3,2.25; 3 -4.3,1.75; 4 -4.3,1.25; 5 -4.3,0.75; 6 -4.3,0.25; 7 -4.3,-0.25; 8 -4.3,-0.75; 9 -4.3,-1.25; 10 -4.3,-1.75; 11 -4.3,-2.25; 12 -4.3,-2.75; 25 4.3,-2.75; 26 4.3,-2.25; 27 4.3,-1.75; 28 4.3,-1.25; 29 4.3,-0.75; 30 4.3,-0.25; 31 4.3,0.25; 32 4.3,0.75; 33 4.3,1.25; 34 4.3,1.75; 35 4.3,2.25; 36 4.3,2.75 | smd 0.3 x 1.4: 13 -2.75,-4.3; 14 -2.25,-4.3; 15 -1.75,-4.3; 16 -1.25,-4.3; 17 -0.75,-4.3; 18 -0.25,-4.3; 19 0.25,-4.3; 20 0.75,-4.3; 21 1.25,-4.3; 22 1.75,-4.3; 23 2.25,-4.3; 24 2.75,-4.3; 37 2.75,4.3; 38 2.25,4.3; 39 1.75,4.3; 40 1.25,4.3; 41 0.75,4.3; 42 0.25,4.3; 43 -0.25,4.3; 44 -0.75,4.3; 45 -1.25,4.3; 46 -1.75,4.3; 47 -2.25,4.3; 48 -2.75,4.3
SO08 = smd 0.72 x 1.78: 1 -1.905,-2.35; 2 -0.635,-2.35; 3 0.635,-2.35; 4 1.905,-2.35; 5 1.905,2.35; 6 0.635,2.35; 7 -0.635,2.35; 8 -1.905,2.35
11-4M1S = smd 1 x 0.5: 1 -3.24,1.27; 2 -3.24,-1.27; 3 3.24,-1.27; 4 3.24,1.27
SOIC127P600X175-8 = smd 1.968 x 0.602: 1 -2.473,1.905; 2 -2.473,0.635; 3 -2.473,-0.635; 4 -2.473,-1.905; 5 2.473,-1.905; 6 2.473,-0.635; 7 2.473,0.635; 8 2.473,1.905
SOT65P210X110-6 = smd 1.02 x 0.36: 1 -0.955,0.65; 2 -0.955,0; 3 -0.955,-0.65; 4 0.955,-0.65; 5 0.955,0; 6 0.955,0.65
SOIC8 = smd 0.6 x 1.5: 1 -1.905,-2.75; 2 -0.635,-2.75; 3 0.635,-2.75; 4 1.905,-2.75; 5 1.905,2.75; 6 0.635,2.75; 7 -0.635,2.75; 8 -1.905,2.75
SOT95P240X110-3 = smd 1.18 x 0.609: 1 -1.024,0.95; 2 -1.024,-0.95; 3 1.024,0
TO252 = smd 1 x 1.6: 1 -2.28,-4.8; 2 2.28,-4.8 | smd 5.4 x 6.2: 3 0,2.5
X3-SMD-3.6X1.3X0.8MM = smd 0.7 x 1.7: 1 -1.2,0; 2 0,0; 3 1.2,0

### Placement (x,y rotation side)
B1  31.37,15.24 180 bottom
C1  53.85,43.94 90 top
C2  64.52,43.94 90 top
C3  67.56,28.57 180 bottom
C4  56.77,30.99 270 top
C5  56.77,15.75 270 top
C6  54.23,30.73 270 top
C7  54.23,15.49 270 top
C8  44.83,37.21 180 top
C9  45.85,23.11 0 top
C10  49.4,37.21 180 top
C11  49.66,23.11 180 top
C12  48.39,27.43 0 top
C13  [C0603']  41.4,5.84 90 bottom
C14  [C0603']  34.8,5.46 90 bottom
C15  [C0603']  35.05,16.26 270 bottom
C16  [C0603']  42.04,18.03 90 bottom
C17  39.5,28.96 90 top
C18  41.53,25.4 0 top
C19  17.14,19.84 180 bottom
C20  31.37,13.21 0 bottom
C21  27.3,13.34 0 top
C22  27.3,20.07 0 bottom
C23  25.02,21.46 315 top
C24  36.83,25.53 135 top
C25  37.34,20.19 0 bottom
C26  27.73,2.3 90 bottom
C27  33.34,2.3 90 bottom
C28  18.95,2.41 90 bottom
C29  21.62,2.41 90 bottom
C30  13.46,45.97 90 top
C31  11.05,45.59 90 bottom
C32  29.99,46.91 270 top
C33  35.57,47.04 270 top
C34  220p  [C0603']  32.02,34.96 180 top
C35  330p  [C0603']  40.16,47.83 90 top
C36  40.51,37.72 0 top
C37  16.64,12.32 90 bottom
C38  32.64,30.86 270 bottom
C39  19.18,39.24 180 bottom
C40  19.18,36.83 180 bottom
C41  29.21,26.8 90 bottom
D1  46.92,39.35 180 top
D2  46.68,25.21 180 top
D3  47.04,29.81 180 top
D4  47.32,15.41 180 top
D5  36.32,34.54 0 top
D6  39.5,43.18 270 top
D9  52.07,2.54 0 top
D10  54.61,2.54 0 top
D11  57.15,2.54 0 top
F1  13.84,41.66 180 top
H1  75,45 0 top
H2  75,5 0 top
H3  5,45 0 top
H4  5,5 0 top
J1  12.83,31.37 270 top
J2  20.11,8.5 180 top
J3  34.44,8.5 180 top
J4  11.94,17.02 90 top
J5  44.45,10.67 180 top
J6  24.64,38.1 0 top
L1  31.37,40.13 270 top
L2  44.68,46.61 180 top
Q1  61.98,34.29 180 top
Q2  61.72,26.67 0 top
Q3  61.98,19.05 180 top
Q4  61.72,11.43 0 top
Q5  19.2,24.08 180 bottom
R1  54.98,36.63 90 top
R2  54.09,21.01 90 top
R3  56.26,24.77 0 top
R4  56.26,9.53 0 top
R5  67.66,36.14 180 top
R6  67.62,20.92 180 top
R7  51.05,29.72 180 top
R8  51.05,14.22 180 top
R9  62.87,11.94 0 bottom
R10  43.94,6.86 0 bottom
R11  43.94,4.83 0 bottom
R12  35.05,13.08 270 bottom
R13  46.35,18.03 270 bottom
R14  44.2,18.03 90 bottom
R15  43.94,28.32 90 bottom
R16  41.66,28.32 90 bottom
R17  41.53,20.57 0 top
R18  41.53,22.61 180 bottom
R19  29.34,5.59 90 bottom
R20  32.26,5.49 90 bottom
R21  17.63,5.82 90 bottom
R22  20.8,5.92 90 bottom
R23  33.91,44.2 180 bottom
R24  36.49,41.3 90 top
R25  36.42,37.79 90 top
R26  50.8,45.21 270 bottom
R27  46.48,41.59 0 top
R28  42.79,41.67 0 top
R29  19.56,35.56 90 top
R30  6.1,28.96 270 bottom
R31  3.56,28.96 90 bottom
R32  18.75,27.41 90 bottom
R33  26.47,26.01 270 bottom
R34  19.2,28.96 90 top
R35  21.87,27.01 270 bottom
R109  52.07,2.54 270 bottom
R110  54.61,2.54 270 bottom
R111  57.15,2.54 270 bottom
S1  18.7,17.51 90 top
U1  33.27,19.05 45 top
U2  22.23,31.62 270 bottom
U3  26.8,32.26 90 top
U4  22.23,25.53 0 top
U5  47.88,33.53 0 top
U6  47.88,19.43 0 top
U7  37.85,5.46 180 bottom
U8  32.51,39.5 0 bottom
U9  45.42,46.35 90 bottom
U10  35.69,30.86 180 bottom
U11  20.7,45.21 90 bottom
X1  24.13,15.88 270 top

### Tracks (layer width: path | path; a pad name or v marks a point on that pad's centre or on a via)
3V3A  (via drill 0.35)
  Top 0.254: U1.9 29.45,13.46 v29.21,13.46 28.28,13.46 C21.2
  Bottom 0.254: v29.21,13.46 30.52,13.46 C20.2 | U7.3 34.8,6.11 C14.2 35.69,7.2 35.69,9.53 33.91,11.3 31.62,11.3 30.52,12.41 C20.2 | B1.1 C20.2
5V_ISO  (via drill 0.35)
  Top 0.254: U3.8 v21.84,30.35
  Bottom 0.254: U11.2 17.41,47.49 18.16,46.74 18.16,42.61 20.13,40.64 C39.2 20.19,39.31 20.19,36.83 | C40.2 20.19,36.83 | U2.3 21.84,30.99 | 20.19,36.83 20.19,35.94 21.84,34.29 21.84,30.99 | 21.84,30.99 v21.84,30.35 21.21,29.72 U2.5 19.29,29.72 R34.2
  other vias: 19.2,29.81
24V_ISO
  Top 0.508: F1.1 15.27,44.17 14.73,44.7 C30.+
  Bottom 0.508: U11.1 15.9,43.92 15.11,44.7 C30.+ 11.09,44.7 C31.1
!EMS  (via drill 0.35)
  Top 0.152: U1.2 27.93,16.89 27.18,16.89 22.86,21.21 22.86,22.88 24.23,24.26 U4.3
  Top 0.254: U4.3 26.37,25.16 R33.2
  other vias: 26.47,25.16
!EMS_ISO
  Bottom 0.152: J1.6 14.11,29.59 16.38,29.59 17.72,28.26 R32.2
!RESET  (via drill 0.35)
  Top 0.152: U1.7 29.18,14.61 26.29,14.61 24.77,13.08 22.14,13.08 18.7,16.52 18.7,19.81 | 18.7,19.81 S1.P$2 | 18.7,19.81 18.02,19.81 C19.2
  other vias: 18,19.84
+3V3  (via drill 0.35)
  Top 0.152: C24.2 36.41,26.13 38.48,28.19 38.48,29.55 38.73,29.81 C17.2
  Top 0.254: U1.24 37.29,18.92 v36.7,18.92 | J4.8 12.06,19.43 13.72,19.43 14.35,18.8 14.35,17.78 15.62,16.51 v15.88,16.51 | U4.4 27.43,26.8 v28.89,28.26 29.08,28.45 29.08,30.35 U3.1 | C24.2 36.23,25.89 U1.36 | v26.29,21.84 26.29,21.53 C23.2 26.13,20.86 26.92,20.07 27.57,20.07 27.97,20.46 U1.48 | C24.2 v35.56,26.8 35.43,26.92 v31.5,26.92 | C24.2 36.41,26.13
  Bottom 0.152: C17.2 40.77,28.54 40.77,26.8 42.16,25.4 C18.2
  Bottom 0.254: v15.88,16.51 16.13,16.76 20.57,16.76 25.65,21.84 v26.29,21.84 26.54,22.1 29.46,22.1 31.11,23.75 31.11,26.67 31.37,26.92 | v36.7,18.92 36.7,20.19 C25.2 36.36,20.07 34.8,20.07 34.48,19.75 | B1.2 32.22,17.49 34.48,19.75 | 34.48,19.75 33.27,20.95 33.27,24.77 35.31,26.8 v35.56,26.8 | v28.89,28.26 29.21,27.94 C41.2 29.25,27.69 31.37,27.69 | U10.2 32.64,31.81 C38.1 32.64,31.46 31.81,30.63 31.81,28.13 31.37,27.69 | 31.37,26.92 31.37,27.69 | v31.5,26.92 31.37,26.92
  Bottom 0.508: v26.29,21.84 26.29,20.13 C22.2
  other vias: 39.5,29.81 42.38,25.4
+5V  (via drill 0.35)
  Top 0.254: v15.88,11.3 15.24,11.94 15.24,16.26 J4.5
  Top 0.508: C36.+ 39.24,39.4 R24.2 31.46,42.15 L1.P$2
  Bottom 0.152: 36.45,30.6 U10.3
  Bottom 0.508: 36.45,30.6 36.45,28.83 32.64,25.02 32.64,20.45 23.5,11.3 | 16.64,11.3 23.5,11.3 | 16.64,11.3 v15.88,11.3 15.11,10.53 J2.2 | C37.1 16.64,11.3 | U10.3 36.58,31 39.24,33.66 C36.+ | 23.5,11.3 28.32,11.3 29.44,10.19 J3.2
+15V
  Top 0.508: C8.1 45.61,37.28 45.61,39.35 D1.A 45.49,39.74 R27.2 47.33,45.88 L2.P$2 | C8.1 45.68,35.71 U5.1 | C8.1 45.68,35.75 46.8,34.63 46.8,28.17 | 46.8,28.17 C12.1 | 46.8,28.17 46.8,26.76 D2.A 45.25,23.37 C9.1 45,21.75 U6.1
A_OUT
  Top 0.508: R1.2 55.85,38.35 66.42,38.35 68.51,36.27 R5.1
  pour Top (rank 2, no thermals): 63.5,30.86 63.12,30.48 60.45,30.48 60.45,22.99 73.28,22.99 73.28,27.94 70.48,30.73 70.48,37.21 63.37,37.21 63.5,37.08
B_OUT
  Top 0.508: R2.2 55.81,21.86 56.69,22.73 66.66,22.73 R6.1
  pour Top (rank 3, no thermals): 73.28,22.61 65.66,22.61 65.02,21.97 63.37,21.97 63.5,21.84 63.5,15.75 62.99,15.24 60.45,15.24 60.45,8.64 67.31,8.64 73.28,14.61
CANH  (via drill 0.35)
  Top 0.254: J6.1 22.35,36.83 20.57,35.05 20.57,33.91 19.3,32.64 18.29,32.64 18.16,32.51 | 18.16,32.51 13.97,28.32 11.94,28.32 11.42,27.8 J1.1 | v18.41,32.26 18.16,32.51
  Bottom 0.254: U2.7 v18.41,32.26
CANL  (via drill 0.35)
  Top 0.254: 16.57,31.56 13.83,28.82 J1.2 | v16.13,32 16.57,31.56 | 16.57,31.56 18.16,33.15 19.18,33.15 19.94,33.91 19.94,34.71 R29.1
  Bottom 0.254: U2.6 17.14,30.99 v16.13,32
CANRX
  Top 0.152: U1.45 28.32,22.23 28.32,22.61 27.43,23.5 27.43,24.51 30.86,27.94 30.86,31.5 30.48,31.88 30.48,32.64 30.23,32.89 U3.3
CANTX
  Top 0.152: U3.2 30.23,31.62 30.48,31.37 30.48,28.07 27.05,24.64 27.05,23.37 27.94,22.48 27.94,21.91 U1.46
ENC_A  (via drill 0.35)
  Top 0.152: U1.10 28.26,11.56 21.11,11.56 18.9,9.35 18.9,6.81 v18.8,6.71
  Bottom 0.152: C28.2 18.95,3.65 R21.1 18.38,4.97 18.8,5.38 v18.8,6.71
ENC_B  (via drill 0.35)
  Top 0.152: U1.11 28.58,11.18 24.59,11.18 v23.77,10.36
  Bottom 0.152: v23.77,10.36 23.57,10.16 23.57,6.91 22.15,5.49 21.22,5.49 R22.1 21.61,4.25 C29.2
GNDA  (via drill 0.35, 0.4)
  Bottom 0.152: J1.YC 14.73,35.87 14.02,36.58 9.75,36.58 4.53,31.35 4.53,26.07 3.66,25.2 3.66,21.23 2.74,20.32 v2.54,20.32
  other vias: 78.74,10.16 78.74,12.7 78.74,15.24 78.74,17.78 78.74,20.32 78.74,22.86 78.74,25.4 78.74,27.94 78.74,30.48 78.74,33.02 78.74,35.56 78.74,38.1 78.74,40.64 78.74,7.62 33.27,19.81 27.13,27.79 28.19,28.96 43.94,21.72 44.07,26.42 37.85,39.12 76.2,25.4 76.2,27.94 76.2,30.48 76.2,33.02 76.2,35.56 76.2,38.1 76.2,40.64 76.2,22.86 76.2,20.32 76.2,17.78 76.2,15.24 76.2,12.7 76.2,10.16 73.66,10.16 73.66,12.7 71.12,10.16 71.12,7.62 68.58,2.54 71.12,2.54 78.74,2.54 66.04,7.62 66.04,2.54 63.5,2.54 63.5,5.08 60.96,7.62 60.96,2.54 58.42,2.54 55.88,2.54 53.34,2.54 50.8,2.54 50.8,10.16 39.37,7.62 38.35,18.8 45.09,27.81 35.56,2.54 35.94,5.21 33.48,5.33 29.39,3.61 33.38,10.16 25.4,10.48 25.4,2.54 15.24,5.08 12.7,2.54 25.5,12.18 10.16,5.08 10.16,2.54 10.16,7.62 10.16,10.16 7.62,10.16 25.4,7.62 5.08,10.16 2.54,10.16 40.51,33.27 33.91,33.15 27.94,38.1 50.29,42.8 55.88,45.72 55.88,48.26 53.34,48.26 50.8,49.02 58.42,48.26 58.42,45.72 60.96,45.72 60.96,48.26 63.5,48.26 66.04,48.26 68.58,48.26 71.12,48.26 68.58,45.72 68.58,43.18 66.04,43.18 68.58,40.64 71.12,40.64 73.66,40.64 73.66,38.1 71.12,38.1 73.66,35.56 78.74,48.26 43.69,16.76 46.99,21.59 46.99,37.21 43.03,40.18 46.74,38.73 50.67,39.37 38.1,30.48 33.91,12.45 50.04,15.88 36.45,7.24 29.84,29.34 28.19,26.67 31.75,21.59 27.18,21.46 23.44,22.68 24.38,23.62 22.25,21.59 30.48,26.54 23.09,17.91 24.49,25.5 35.18,11.05 25.91,15.88 27.18,18.41 24.89,20.07 32.13,25.91 34.92,25.53 28.83,25.02 46.61,24.89 43.05,22.86 39.62,21.84 36.96,23.75 35.31,20.83 36.58,27.56 33.91,21.97 27.84,12.22 16.23,18.9 19.63,18.85 22.58,15.82 31.88,18.29 35.18,19.3 33.4,16.89 33.4,13.84 36.2,1.46 43.05,2.1 45.72,2.1 39.88,4.19 58.42,7.62 55.88,7.62 53.34,7.62 50.8,7.62 48.26,7.62 42.67,16.26 43.43,13.72 41.53,15.11 40.01,31.62 38.35,26.8 33.02,27.94 32.97,45.77 27.94,41.78 28.7,35.18 41.66,36.07 37.97,36.45 32.82,47.45 42.8,27.56 46.99,4.19 66.04,5.08 60.96,4.95 58.42,4.95 55.88,4.95 50.04,26.04 40.64,40.64 17.78,12.7 17.78,15.24 21.59,15.24 21.23,12.7 30.48,20.32 37.95,41.91 41.12,47.75 43.18,35.56 41.05,43.1 31.5,16.51 11.94,17.91 11.94,16.13 7.62,20.32 5.08,20.32 13.59,14.48 39.37,16.89 43.56,33.78 47.5,35.31 48.01,18.8 14.48,13.59 41.4,39.24 44.5,47.68 45.72,42.67 41.05,44.63 44.65,40.79 27.94,45.72 48.36,28.4 28.35,48.11 29.97,35.69 28.83,39.88 25.04,27.64 29.87,25.1 41.15,24.38 33.91,30.86 41.66,31.11 15.24,20.32 27.94,43.18 38.05,45.03 38.23,47.75 20.12,20.12 30.86,33.27 41.02,18.03 46.99,13.46 44.45,13.46 41.91,13.46 39.22,13.21 47.62,32.64 30.35,10.67 31.11,40.13 35.43,39.62 30.48,49.17
  pour Top (rank 6, no thermals): 0,0.5 0,21.97 21.01,21.97 23.52,24.49 23.52,27.28 24.56,28.32 26.8,28.32 27.56,29.08 27.56,49.7 79.88,49.7 79.88,0.5
  pour Bottom (rank 6, no thermals): 27.56,49.8 79.76,49.8 79.76,0.5 0,0.5 0,21.82 21.01,21.82 23.52,24.33 23.52,27.13 24.87,28.47 26.95,28.47 27.56,29.08
GNDIO  (via drill 0.35)
  other vias: 17.32,26.54 11.94,29.84 14.22,27.3 16.92,30.15 22.05,24.79 13.97,31.75 15.75,28.57 12.19,27.3 22.48,32.13 12.32,25.53 2.54,22.99 2.54,25.4 2.41,27.94 5.21,26.92 7.62,28.7 10.16,27.05 7.62,30.1 5.21,30.73 2.54,30.48 2.54,33.02 13.97,34.29 15.24,33.02 2.54,35.56 2.54,38.1 2.54,40.64 7.62,40.64 10.16,40.64 10.16,43.18 10.16,45.72 17.78,48.26 12.7,48.26 10.16,48.26 15.24,48.51 25.4,48.26 25.4,40.64 25.4,38.1 20.37,23.16 25.4,35.56 22.86,35.56 17.78,40.64 7.62,33.02 12.7,43.18 20.32,48.26 22.86,48.26 25.4,45.72 25.4,43.18 22.86,43.18 20.32,43.18 20.32,45.72 22.86,45.72 15.24,45.72 17.12,24.84 20.47,28.4 21.21,31.62 26.67,31.75 26.67,34.29 4.57,22.99 16.89,37.21 13.97,39.12 13.97,24.13 21.59,29.21 21.21,34.04 22.86,40.64 6.35,31.75 5.08,35.56 20.83,37.97 24.13,48.26 25.4,46.99 22.86,46.99 24.13,45.72 24.13,46.99 25.4,44.45 24.13,44.45 22.86,44.45 24.13,43.18 25.4,41.91 22.86,41.91 24.13,41.91 21.59,41.91 20.32,41.91 21.59,43.18 21.59,44.45 21.59,45.72 20.32,44.45 21.59,46.99 20.32,46.99 21.59,48.26 20.95,48.9 22.23,48.9 23.5,48.9 24.77,48.9 26.04,48.9 26.04,47.62 26.04,46.35 26.04,45.09 26.04,43.81 26.04,42.55 26.67,43.18 26.67,44.45 26.67,45.72 26.67,46.99 26.67,48.26 24.77,46.35 24.77,47.62 23.5,47.62 23.5,46.35 23.5,45.09 22.23,47.62 22.23,46.35 20.95,47.62 20.95,46.35 20.95,45.09 22.23,45.09 22.23,43.81 20.95,43.81 20.95,42.55 22.23,42.55 23.5,42.55 24.77,42.55 24.77,43.81 23.5,43.81 24.77,45.09 26.67,41.91 19.68,42.55 19.68,43.81 19.68,45.09 19.68,46.35 19.68,47.62 19.68,48.9
  pour Bottom (rank 5, no thermals): 0,49.8 26.92,49.8 26.92,29.46 26.42,28.96 24.46,28.96 23.04,27.53 23.04,24.71 20.62,22.3 0,22.3
  pour Top (rank 5, no thermals): 0,22.45 0,49.7 26.92,49.7 26.92,29.46 26.42,28.96 24.46,28.96 23.04,27.53 23.04,24.87 20.62,22.45
IN_A  (via drill 0.35)
  Top 0.152: R19.1 28.19,5.88 28.19,10.08 U1.12
  Bottom 0.152: C26.2 29.31,4.74 R19.1
  other vias: 29.34,4.74
IN_B  (via drill 0.35)
  Top 0.152: U1.13 34.5,13.93 30.73,10.16 30.73,6.13 v32.26,4.61
  Bottom 0.152: R20.1 v32.26,4.61 33.34,3.53 C27.2
IN_HI_A  (via drill 0.35)
  Top 0.305: U1.30 37.82,23.24 38.35,23.24 38.73,23.62 38.73,26.16 39.88,27.3 41.49,27.3 R16.1 42.8,28.61 42.8,32 44.96,34.16 U5.2
  other vias: 41.66,27.47
IN_HI_B  (via drill 0.35)
  Top 0.305: U1.29 37.76,22.48 v37.97,22.48 | v43.48,20.09 45.38,20.09 U6.2
  Bottom 0.305: v37.97,22.48 40.55,22.48 R18.1 43.2,20.09 v43.48,20.09
IN_LO_A  (via drill 0.35)
  Top 0.152: 45.38,32.91 U5.3
  Top 0.305: U1.27 38.73,22.04 38.73,22.86 39.37,23.5 39.37,26.04 40.05,26.71 43.19,26.71 R15.1 43.94,31.88 44.98,32.91 45.38,32.91
  other vias: 43.94,27.47
IN_LO_B
  Top 0.152: R17.1
  Top 0.305: U1.26 38.49,21.08 40.39,21.08 40.67,20.79 R17.1 | R17.1 41.92,19.33 44.87,19.33 U6.3
ISENSE  (via drill 0.35)
  Top 0.254: v33.66,15.88 33.66,15.49 U1.14
  Bottom 0.254: R12.1 C15.2 34.12,15.41 v33.66,15.88
JMP0
  Top 0.152: U1.19 38.61,14.07 38.61,12.95 39.37,12.19 J5.9
JMP1
  Top 0.152: U1.20 39.6,13.78 40.07,13.78 J5.7
JMP2
  Top 0.152: U1.21 39.99,14.1 42.16,14.1 44.32,11.94 J5.5
JMP3
  Top 0.152: U1.22 40.32,14.48 44.32,14.48 46.86,11.94 J5.3
JMP4
  Top 0.152: J5.1 49.4,11.94 47.24,14.1 45.21,14.1 44.45,14.86 43.16,14.86 38.26,19.77 U1.25
LED0  (via drill 0.35)
  Top 0.152: U1.16 37.41,13.14 37.41,2.67 38.66,1.42 v39.4,1.42
  Bottom 0.152: R109.1 50.55,3.39 48.58,1.42 v39.4,1.42
LED1  (via drill 0.35)
  Top 0.152: v38.63,2.85 37.74,3.73 37.74,13.52 U1.17
  Bottom 0.152: R110.1 53.81,4.19 50.8,4.19 49.38,2.77 38.71,2.77 v38.63,2.85
LED2  (via drill 0.35)
  Top 0.152: U1.18 38.08,13.9 38.08,4.04 38.68,3.43 40.84,3.43 v40.87,3.4
  Bottom 0.152: R111.1 56.35,4.19 54.36,4.19 53.98,4.57 50.67,4.57 49.53,3.43 40.87,3.43 v40.87,3.4
LED_CAN  (via drill 0.35)
  Top 0.152: v3.56,27.69 7.24,27.69 9.02,25.91 10.67,25.91 15.54,21.03 v16.76,21.03 | U1.3 28.26,16.51 27.05,16.51 22.53,21.03 v20.17,21.03
  Bottom 0.152: v3.56,27.69 R31.1 | v20.17,21.03 v16.76,21.03
N$1
  Top 0.381: U5.7 50.85,34.16 53.33,36.64 55.68,36.64 56.5,37.47 63.43,37.47 Q1.4
  Top 0.508: Q1.4 66.86,36.2 R5.2
N$2
  Top 0.381: U6.7 52.47,20.07 53.4,21 55.96,21 56.99,22.03 63.28,22.03 64.35,20.95 Q3.4 | 66.8,20.95 R6.2
  Top 0.508: Q3.4 66.8,20.95
N$3  (via drill 0.35)
  Top 0.254: v54.61,1.27 D10.A
  Bottom 0.254: R110.2 v54.61,1.27
N$4
  Top 0.508: R1.1 53.83,35.78 51,32.95 50.41,32.95 U5.6 50.28,32.97 48.47,32.97 | D3.C 48.47,32.97 | C10.2 48.47,37.13 48.47,32.97
N$5
  Top 0.508: R4.1 52.58,9.53 50.93,11.18 50.93,14.22 | 50.93,14.22 50.93,17.53 U6.5 | R8.2 50.93,14.22
N$6
  Bottom 0.254: U7.6 38.12,4.81 37.85,5.08 37.85,6.99 36.45,8.38 36.45,10.83 R12.2
N$7  (via drill 0.35)
  Top 0.254: D9.A v52.07,1.27
  Bottom 0.254: v52.07,1.27 R109.2
N$8
  Top 0.508: F1.2 12.83,41.25 12.83,32.51 11.17,30.86 J1.4 10.42,30.86 9.4,31.88 J1.5
  Bottom 0.152: R30.1 6.18,29.81 7.37,30.99 8.13,30.99 J1.5
N$9
  Top 0.254: J6.2 21.08,39.37 19.56,37.85 R29.2
N$10
  Top 0.254: X1.3 25.65,14.68 26.22,15.24 29.11,15.24 U1.6
N$11
  Top 0.508: 50.93,29.72 R7.2 | U5.5 50.93,31.62 50.93,29.72 | 50.93,29.72 50.93,25.91 52.07,24.77 R3.1
N$12
  Bottom 0.152: R22.2 20.11,7.46 J2.4
N$13
  Bottom 0.508: R23.2 34.76,42.59 U8.8 | U8.7 U8.8 | U8.8 U8.1
N$14  (via drill 0.35)
  Top 0.508: L1.P$1 32.45,38.21 33.15,37.51 U8.2 33.15,36.32 34.89,34.57 D5.C
  other vias: 33.15,36.75
N$15
  Bottom 0.152: J3.4 34.42,8.5 R20.2
N$16
  Bottom 0.152: R21.2 J2.3
N$17
  Bottom 0.152: R19.2 29.89,6.44 J3.3
N$18  (via drill 0.35)
  Top 0.152: J1.GA 15.19,26.87 14.61,26.29 9.14,26.29 7.11,28.32 v6.1,28.32
  Bottom 0.152: R30.2 v6.1,28.32
N$19
  Top 0.254: X1.1 25.6,17.07 26.92,15.75 28.91,15.75 U1.5
N$20
  Bottom 0.152: J1.YA 14.15,36.96 9.53,36.96 3.94,31.37 3.94,29.81 R31.2
N$21  (via drill 0.35)
  Top 0.254: D11.A v57.15,1.27
  Bottom 0.254: v57.15,1.27 R111.2
N$22
  Bottom 0.254: Q5.1 18.31,26.12 R32.1 21.47,26.56 R35.2
N$23  (via drill 0.35)
  Top 0.152: U3.7 23.37,31.62 23.11,31.88 23.11,33.15 v22.99,33.27
  Bottom 0.152: v22.99,33.27 23.24,33.53 U2.1
N$24  (via drill 0.35)
  Bottom 0.508: U8.3 31.93,36.69 31.93,35.45 32.42,34.96 C34.1
  other vias: 32.88,34.96
N$25
  Top 0.508: R2.1 52.73,18.8 U6.6 48.81,18.8 | C11.2 48.81,18.8 | 48.81,18.8 48.81,15.47 D4.C
N$26  (via drill 0.35)
  Top 0.508: R25.2 36.49,38.71 R24.1 36.42,40.38 v32.01,40.38 v32,40.39
  Bottom 0.508: v32,40.39 31.99,40.39 30.61,41.77 U8.5
N$27  (via drill 0.35)
  Top 0.152: U3.6 25.65,32.89 25.91,32.64 v25.91,29.72
  Bottom 0.152: v25.91,29.72 U2.4
N$28
  Bottom 0.152: R26.2 50.71,44.45
  Bottom 0.508: U9.7 U9.8 | U9.1 U9.8 | 50.71,44.45 U9.8
N$29  (via drill 0.35)
  Top 0.152: L2.P$1 42.75,46.49
  Top 0.508: D6.C 40.61,45.72 U9.2 42.75,45.81 42.75,46.49
  other vias: 42.67,45.72
N$30  (via drill 0.35)
  Top 0.254: Q5.3 18.98,23.28 U4.2
  other vias: 19.2,23.06
N$31
  Top 0.152: R34.1 19.2,27.01 U4.1
N$32  (via drill 0.35)
  Bottom 0.508: C35.1 42.65,46.98 U9.3
  other vias: 40.16,46.98
N$33  (via drill 0.35)
  Top 0.508: R28.2 44.96,41.67 | 44.96,41.67 45.54,41.67 R27.1 | v44.9,46.63 44.9,41.74 44.96,41.67
  Bottom 0.508: U9.5 48.11,48.2 46.47,48.2 v44.9,46.63
N$36
  Bottom 0.254: C13.2 41.4,6.73 41.53,6.73 | R10.2 42.97,6.73 41.53,6.73 | U7.4 40.91,6.11 41.53,6.73
N$37
  Bottom 0.254: C13.1 41.4,4.95 | R11.2 42.97,4.95 41.4,4.95 | U7.5 40.89,5.46 41.4,4.95
N$61
  Top 0.508: Q2.4 R3.2
N$64
  Top 0.508: R4.2 Q4.4
N$67
  Top 0.508: U6.8 50.67,21.34 50.67,23.11 C11.1 50.43,23.11 48.33,25.21 D2.C
N$73
  Top 0.508: D1.C 50.25,37.44 C10.1 50.35,37.11 U5.8
SWCLK  (via drill 0.35)
  Top 0.152: U1.37 31.45,24.77 30.99,24.77 v29.84,23.62
  Bottom 0.152: v29.84,23.62 29.08,23.62 28.7,24 28.19,24 27.43,23.24 25.4,23.24 20.07,17.91 14.86,17.91 13.72,16.76 11.68,16.76 J4.4
SWDIO  (via drill 0.35)
  Top 0.152: U1.34 34.35,22.61 34.16,22.61 31.62,25.15 30.86,25.15 29.97,24.26 v29.34,24.26
  Bottom 0.152: v29.34,24.26 29.21,24.38 28.07,24.38 27.3,23.62 25.27,23.62 19.94,18.29 14.73,18.29 13.72,17.27 11.68,17.27 J4.6
UART_RX  (via drill 0.35)
  Top 0.152: U1.43 29.24,22.73 v28.96,22.73
  Bottom 0.152: v28.96,22.73 28.45,22.73 28.19,22.48 25.65,22.48 20.32,17.14 15.11,17.14 14.22,16.26 14.22,14.22 J4.1
UART_TX  (via drill 0.35)
  Top 0.152: U1.42 29.31,23.37 v28.45,23.37
  Bottom 0.152: v28.45,23.37 27.94,22.86 25.53,22.86 20.19,17.53 14.99,17.53 J4.3
VCC  (via drill 0.35, 0.4)
  Top 0.61: C7.1 v51.95,16.89 v51.94,16.89
  Bottom 0.61: v51.94,16.89 46.65,16.89 R13.2
  Bottom 0.813: R26.1 51.45,46.06 53.85,43.66 C1.+ | R26.1 49.87,46.99 U9.6 | R26.1 49.78,47.08 49.78,48.79 49.45,49.12 46.53,49.12 46.45,49.19 36.71,49.19 | 36.71,49.19 C33.+ | 36.71,49.19 32.5,49.19 31.88,48.57 31.88,47.85 | U8.6 31.88,44.04 | 31.88,44.04 31.88,47.85 | 31.88,44.04 32.03,44.2 R23.1 | C32.+ 31.81,47.92 31.88,47.85
  other vias: 59.05,21.21 59.05,19.68 61.34,15.88 60.58,15.88 59.82,16.64 58.29,19.68 62.1,15.88 59.05,20.45 58.29,20.45 58.29,21.21 59.05,17.4 59.05,18.92 59.82,17.4 60.58,17.4 59.05,18.16 58.29,18.92 58.29,18.16 58.29,17.4 58.29,16.64 60.58,16.64 59.05,16.64 61.34,16.64 62.1,16.64 62.87,15.88 62.87,16.64 58.29,36.58 58.29,35.81 59.05,36.58 59.05,35.81 58.29,35.05 58.29,34.29 58.29,33.53 58.29,32.77 58.29,32 59.05,32 59.05,32.77 59.82,32 60.58,32 60.58,31.24 61.34,31.24 62.1,31.24 62.87,31.24 61.34,32 62.1,32 62.87,32 62.87,32.77 61.34,32.77 59.82,32.77 60.58,32.77 59.05,33.53 59.82,33.53 60.58,33.53 61.34,33.53 62.1,32.77 62.1,33.53 62.87,33.53 62.1,34.29 62.87,34.29 61.34,34.29 60.58,34.29 59.82,34.29 59.05,34.29 59.05,35.05 59.82,35.05 60.58,35.05 61.34,35.05 62.1,35.05 62.87,35.05 62.87,35.81 62.87,36.58 62.1,36.58 62.1,35.81 61.34,35.81 61.34,36.58 60.58,36.58 60.58,35.81 59.82,35.81 59.82,36.58 61.34,17.4 62.1,17.4 62.87,17.4 62.87,18.16 62.1,18.16 61.34,18.16 60.58,18.16 59.82,18.16 59.82,18.92 60.58,18.92 61.34,18.92 62.1,18.92 62.87,18.92 62.87,19.68 62.1,19.68 61.34,19.68 60.58,19.68 59.82,19.68 59.82,20.45 60.58,20.45 61.34,20.45 62.1,20.45 62.87,20.45 62.87,21.21 62.1,21.21 61.34,21.21 60.58,21.21 59.82,21.21 59.82,15.88 59.05,15.88 59.82,31.24 59.05,31.24 58.29,31.24
  pour Top (no thermals): 57.66,21.84 63.25,21.84 63.25,15.75 62.99,15.49 58.93,15.49 58.42,16 52.83,16 52.7,16.13 52.7,17.53 53.21,18.03 53.85,18.03
  pour Top (no thermals): 57.66,37.08 63.25,37.08 63.25,30.99 62.99,30.73 58.17,30.73 57.66,31.24 52.83,31.24 52.7,31.37 52.7,33.02 52.96,33.27 53.85,33.27
  pour Bottom (rank 2, no thermals): 65.6,15.49 58.93,15.49 57.91,16.51 57.91,30.73 55.12,33.53 52.45,33.53 51.44,34.54 51.44,42.04 52.32,42.93 64.99,42.93 74.42,33.49 74.42,29.46 67.94,29.46 67.56,29.08 67.56,17.53
VCS  (via drill 0.35)
  Top 0.508: C12.2 49.24,25.57 49.66,25.15 50.67,25.15 51.82,24
  other vias: 57.28,30.48 57.28,29.72 56.52,29.72 57.28,28.96 57.28,28.19 57.28,27.43 57.28,26.67 57.28,25.91 56.52,30.48 56.52,28.96 56.52,28.19 56.52,27.43 56.52,26.67 56.52,25.91 55.75,25.91 55.75,26.67 55.75,27.43 55.75,30.48 54.99,30.48 54.23,30.48 53.47,30.48 52.7,30.48 52.7,29.72 53.47,29.72 55.75,28.19 55.75,28.96 55.75,29.72 54.99,29.72 54.23,29.72 54.99,28.96 54.99,28.19 54.99,27.43 54.99,25.91 54.23,25.91 53.47,25.91 52.7,25.91 54.99,26.67 51.94,26.67 51.94,27.43 51.94,28.19 51.94,28.96 51.94,29.72 54.23,28.96 54.23,28.19 54.23,27.43 54.23,26.67 53.47,26.67 53.47,27.43 53.47,28.19 53.47,28.96 52.7,28.96 52.7,28.19 52.7,27.43 52.7,26.67 51.94,30.48 51.94,31.24 51.94,32 57.28,10.67 57.28,11.43 56.52,10.67 56.52,11.43 56.52,12.19 57.28,12.19 55.75,10.67 57.28,12.95 57.28,13.72 57.28,14.48 57.28,15.24 54.99,10.67 54.23,10.67 53.47,10.67 52.7,10.67 52.7,11.43 51.94,11.43 53.47,11.43 54.23,11.43 54.99,11.43 55.75,11.43 51.94,12.19 51.94,12.95 51.94,13.72 51.94,14.48 51.94,15.24 56.52,15.24 55.75,15.24 54.99,15.24 54.23,15.24 53.47,15.24 52.7,15.24 55.75,12.19 54.99,12.19 54.23,12.19 53.47,12.19 52.7,12.19 52.7,12.95 53.47,12.95 54.23,12.95 54.99,12.95 55.75,12.95 56.52,12.95 56.52,13.72 56.52,14.48 55.75,14.48 55.75,13.72 54.99,13.72 54.99,14.48 54.23,14.48 54.23,13.72 53.47,13.72 53.47,14.48 52.7,14.48 52.7,13.72 51.94,16 54.99,22.99 51.96,17.94 55.88,23.35 53.34,24 52.07,21.59
  pour Top (rank 4, no thermals): 51.44,32.38 51.44,11.3 53.09,9.65 60.2,9.65 60.2,30.73 59.56,31.37 52.58,31.37 52.58,33.27 52.32,33.27
  pour Bottom (rank 3, no thermals): 57.66,33.15 57.66,16.38 58.8,15.24 62.74,15.24 62.74,8.76 53.98,8.76 51.44,11.3 51.44,32 52.58,33.15
VCS_B_N
  Bottom 0.254: R9.1S 63.45,11.94 63.07,11.56 63.07,6.77 61.93,5.64 45.52,5.64 44.79,4.91 R11.1
VCS_B_P
  Bottom 0.254: R10.1 44.79,6.77 45.52,6.04 61.77,6.04 62.66,6.94 62.66,11.56 62.28,11.94 R9.2S
VSENSE  (via drill 0.35)
  Top 0.254: U1.15 34.29,15.56 34.29,17.27 v35.18,18.16
  Bottom 0.254: R13.1 R14.2 C16.2 40.73,18.88 40.01,18.16 v35.18,18.16

### Text on the board
tPlace: DBG | CONF | ENC | DIN | MD2020 | Chiba.Robot.Studio | 8th, Feb. '20.
bPlace: GND | +5V | ENC_A | ENC_B | GND | +5V | DIN_A | DIN_B
tNames: RST
_tNames: OUT+ | OUT-
_bNames: VM+ | VM-